# Altium project PCBLaserControlBoardV1.0.PrjPcb (part 1 of 2)
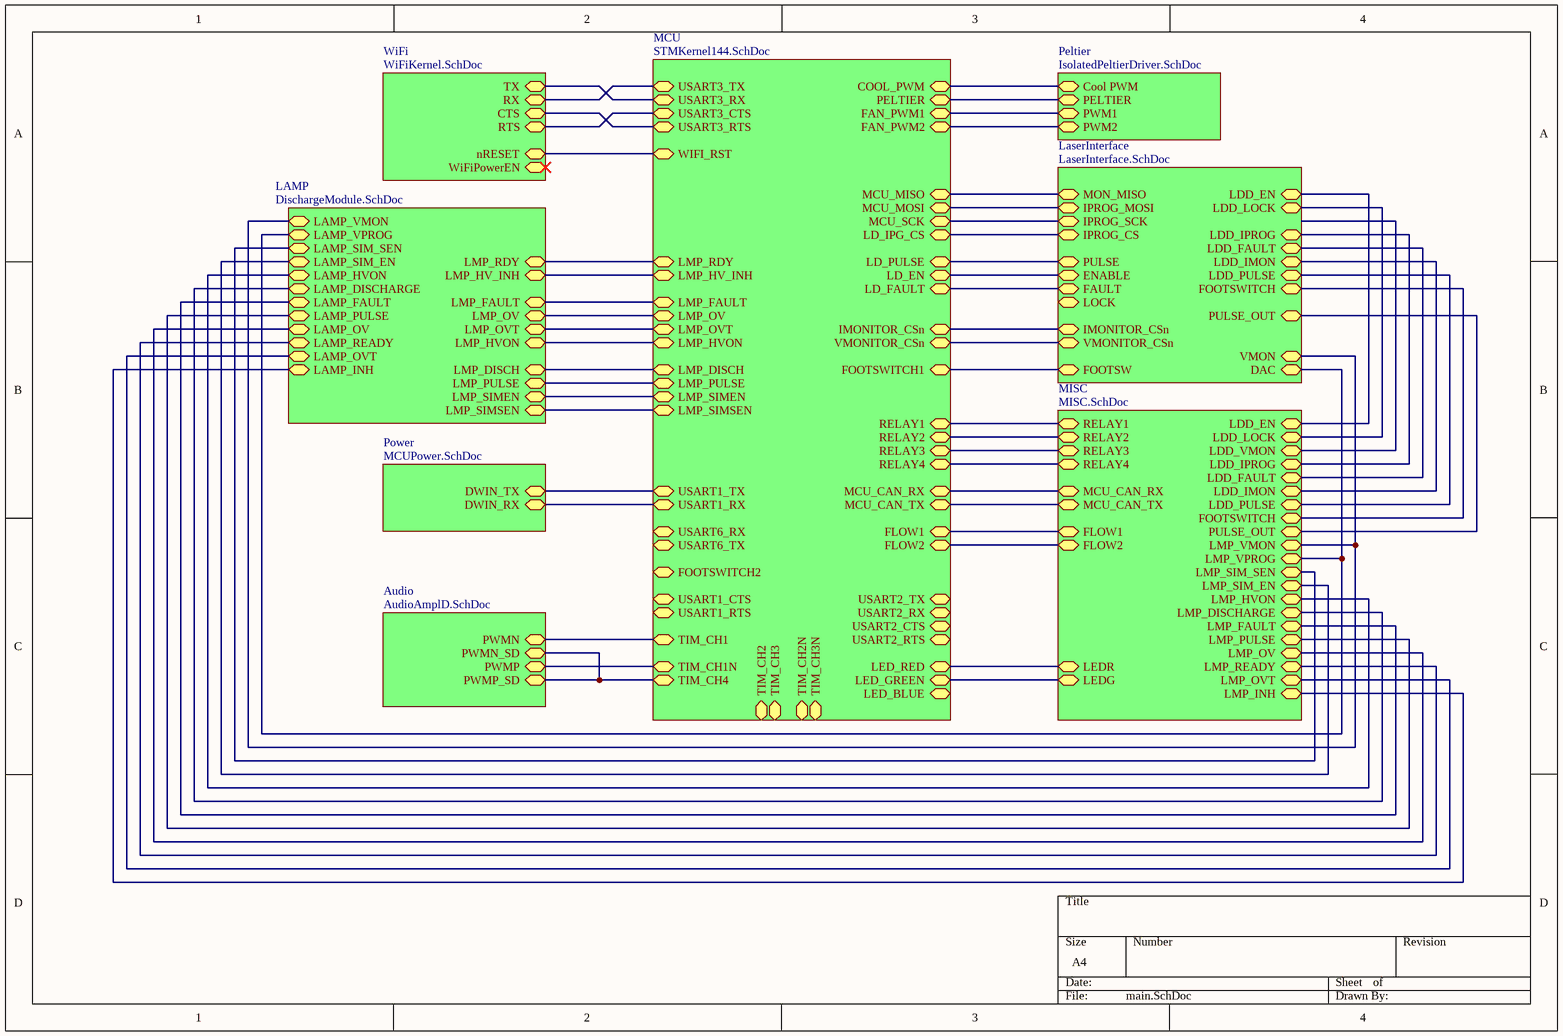
[diagram p0: main.SchDoc]
9 sheets, 386 parts. Net scope: hierarchical (ports join the sheet entries above them; power ports are global).
Board file: LaserControlBoard (extended).PcbDoc
Sheets:
  main.SchDoc
    MCU = STMKernel144.SchDoc
    Peltier = IsolatedPeltierDriver.SchDoc
    WiFi = WiFiKernel.SchDoc
    LaserInterface = LaserInterface.SchDoc
    MISC = MISC.SchDoc
    LAMP = DischargeModule.SchDoc
    Power = MCUPower.SchDoc
    Audio = AudioAmplD.SchDoc

## Sheet main.SchDoc
size A4

### Sub-sheets
Audio = AudioAmplD.SchDoc: PWMN, PWMN_SD, PWMP, PWMP_SD
LAMP = DischargeModule.SchDoc: LMP_SIMSEN, LMP_RDY, LMP_SIMEN, LMP_DISCH, LMP_HV_INH, LMP_FAULT, LMP_OV, LMP_OVT, LMP_HVON, LMP_PULSE, LAMP_VMON, LAMP_VPROG, LAMP_SIM_SEN, LAMP_SIM_EN, LAMP_HVON, LAMP_DISCHARGE, LAMP_FAULT, LAMP_PULSE, LAMP_OV, LAMP_READY, LAMP_OVT, LAMP_INH
LaserInterface = LaserInterface.SchDoc: IPROG_MOSI, IPROG_SCK, IPROG_CS, LOCK, FAULT, ENABLE, PULSE, MON_MISO, IMONITOR_CSn, VMONITOR_CSn, FOOTSW, VMON, DAC, LDD_EN, LDD_LOCK, LDD_IPROG, LDD_FAULT, LDD_IMON, LDD_PULSE, FOOTSWITCH, PULSE_OUT
MCU = STMKernel144.SchDoc: MCU_SCK, MCU_MISO, MCU_MOSI, USART2_CTS, USART2_RTS, USART2_TX, USART2_RX, USART3_TX, USART3_RX, USART3_CTS, USART3_RTS, LD_PULSE, LD_EN, LD_FAULT, LD_IPG_CS, COOL_PWM, PELTIER, RELAY1, FAN_PWM1, FAN_PWM2, IMONITOR_CSn, VMONITOR_CSn, RELAY2, RELAY3, RELAY4, FOOTSWITCH1, LED_RED, LMP_SIMSEN, LMP_RDY, LMP_SIMEN, LMP_DISCH, LMP_PULSE, LMP_HV_INH, LMP_FAULT, LMP_OV, LMP_OVT, LMP_HVON, FOOTSWITCH2, FLOW2, FLOW1, LED_GREEN, LED_BLUE, USART6_TX, USART6_RX, USART1_CTS, USART1_RTS, USART1_TX, USART1_RX, WIFI_RST, TIM_CH1, TIM_CH3, TIM_CH2, TIM_CH4, TIM_CH2N, TIM_CH3N, TIM_CH1N, MCU_CAN_RX, MCU_CAN_TX
MISC = MISC.SchDoc: RELAY1, RELAY2, RELAY3, RELAY4, FLOW1, FLOW2, LEDR, LEDG, LMP_VMON, LMP_VPROG, LMP_SIM_SEN, LMP_SIM_EN, LMP_HVON, LMP_DISCHARGE, LMP_FAULT, LMP_PULSE, LMP_OV, LMP_READY, LMP_OVT, LMP_INH, LDD_EN, LDD_LOCK, LDD_VMON, LDD_IPROG, LDD_FAULT, LDD_IMON, LDD_PULSE, FOOTSWITCH, PULSE_OUT, MCU_CAN_RX, MCU_CAN_TX
Peltier = IsolatedPeltierDriver.SchDoc: Cool PWM, PWM1, PWM2, PELTIER
Power = MCUPower.SchDoc: DWIN_TX, DWIN_RX
WiFi = WiFiKernel.SchDoc: nRESET, RX, TX, CTS, RTS, WiFiPowerEN

### Nets
CAN1_RX: sheet MCU/MCU_CAN_RX, sheet MISC/MCU_CAN_RX
CAN1_TX: sheet MCU/MCU_CAN_TX, sheet MISC/MCU_CAN_TX
CH_NERR: sheet LaserInterface/LDD_FAULT, sheet MISC/LDD_FAULT
DAC_CS: sheet MCU/LD_IPG_CS, sheet LaserInterface/IPROG_CS
DAC_MOSI: sheet MCU/MCU_MOSI, sheet LaserInterface/IPROG_MOSI
DAC_SCK: sheet MCU/MCU_SCK, sheet LaserInterface/IPROG_SCK
DWIN_RX: sheet MCU/USART1_RX, sheet Power/DWIN_RX
DWIN_TX: sheet MCU/USART1_TX, sheet Power/DWIN_TX
FLOW1: sheet MCU/FLOW1, sheet MISC/FLOW1
FLOW2: sheet MCU/FLOW2, sheet MISC/FLOW2
FOOTSW1: sheet MCU/FOOTSWITCH1, sheet LaserInterface/FOOTSW
IM_CSn: sheet MCU/IMONITOR_CSn, sheet LaserInterface/IMONITOR_CSn
LAS_EN: sheet MCU/LD_EN, sheet LaserInterface/ENABLE
LAS_FLT: sheet MCU/LD_FAULT, sheet LaserInterface/FAULT
LASER_ENABLE: sheet LaserInterface/LDD_EN, sheet MISC/LDD_EN
LASER_IMON: sheet LaserInterface/LDD_IMON, sheet MISC/LDD_IMON
LASER_IPROG: sheet LaserInterface/DAC, sheet LaserInterface/LDD_IPROG, sheet MISC/LMP_VPROG, sheet MISC/LDD_IPROG, sheet LAMP/LAMP_VPROG
LASER_LOCK: sheet LaserInterface/LDD_LOCK, sheet MISC/LDD_LOCK
LASER_PULSE: sheet LaserInterface/LDD_PULSE, sheet MISC/LDD_PULSE
LASER_VMON: sheet LaserInterface/VMON, sheet MISC/LMP_VMON, sheet LAMP/LAMP_VMON
LD_PULSE: sheet MCU/LD_PULSE, sheet LaserInterface/PULSE
LEDG: sheet MCU/LED_GREEN, sheet MISC/LEDG
LEDR: sheet MCU/LED_RED, sheet MISC/LEDR
LMP_DISCH: sheet MCU/LMP_DISCH, sheet LAMP/LMP_DISCH
LMP_DISCHARGE: sheet MISC/LMP_DISCHARGE, sheet LAMP/LAMP_DISCHARGE
LMP_FAULT: sheet MCU/LMP_FAULT, sheet LAMP/LMP_FAULT
LMP_FAULT_SIG: sheet MISC/LMP_FAULT, sheet LAMP/LAMP_FAULT
LMP_HV_INH: sheet MCU/LMP_HV_INH, sheet LAMP/LMP_HV_INH
LMP_HV_INHIBIT: sheet MISC/LMP_INH, sheet LAMP/LAMP_INH
LMP_HVON: sheet MCU/LMP_HVON, sheet LAMP/LMP_HVON
LMP_HVON_SIG: sheet MISC/LMP_HVON, sheet LAMP/LAMP_HVON
LMP_OV: sheet MCU/LMP_OV, sheet LAMP/LMP_OV
LMP_OVERTEMPERATURE_SIG: sheet MISC/LMP_OVT, sheet LAMP/LAMP_OVT
LMP_OVERVOLTAGE_SIG: sheet MISC/LMP_OV, sheet LAMP/LAMP_OV
LMP_OVT: sheet MCU/LMP_OVT, sheet LAMP/LMP_OVT
LMP_PULSE: sheet MCU/LMP_PULSE, sheet LAMP/LMP_PULSE
LMP_PULSE_OUT: sheet MISC/LMP_PULSE, sheet LAMP/LAMP_PULSE
LMP_RDY: sheet MCU/LMP_RDY, sheet LAMP/LMP_RDY
LMP_READY: sheet MISC/LMP_READY, sheet LAMP/LAMP_READY
LMP_SIMEN: sheet MCU/LMP_SIMEN, sheet LAMP/LMP_SIMEN
LMP_SIMMER_ENABLE: sheet MISC/LMP_SIM_EN, sheet LAMP/LAMP_SIM_EN
LMP_SIMMER_SENSOR: sheet MISC/LMP_SIM_SEN, sheet LAMP/LAMP_SIM_SEN
LMP_SIMSEN: sheet MCU/LMP_SIMSEN, sheet LAMP/LMP_SIMSEN
RELAY1: sheet MCU/RELAY1, sheet MISC/RELAY1
RELAY2: sheet MCU/RELAY2, sheet MISC/RELAY2
RELAY3: sheet MCU/RELAY3, sheet MISC/RELAY3
RELAY4: sheet MCU/RELAY4, sheet MISC/RELAY4
TIM1_CH1: sheet MCU/TIM_CH1, sheet Audio/PWMN
TIM1_CH1N: sheet MCU/TIM_CH1N, sheet Audio/PWMP
TIM1_CH4: sheet MCU/TIM_CH4, sheet Audio/PWMN_SD, sheet Audio/PWMP_SD
USART3_CTS: sheet MCU/USART3_CTS, sheet WiFi/RTS
USART3_RTS: sheet MCU/USART3_RTS, sheet WiFi/CTS
USART3_RX: sheet MCU/USART3_RX, sheet WiFi/TX
USART3_TX: sheet MCU/USART3_TX, sheet WiFi/RX
VM_CSn: sheet MCU/VMONITOR_CSn, sheet LaserInterface/VMONITOR_CSn
WIFI_RST: sheet MCU/WIFI_RST, sheet WiFi/nRESET
NetP9_37: sheet LaserInterface/FOOTSWITCH, sheet MISC/FOOTSWITCH
NetR2_1: sheet MCU/COOL_PWM, sheet Peltier/Cool PWM
NetR10_1: sheet MCU/PELTIER, sheet Peltier/PELTIER
NetR13_1: sheet MCU/FAN_PWM1, sheet Peltier/PWM1
NetR16_1: sheet MCU/FAN_PWM2, sheet Peltier/PWM2
NetR35#1_1: sheet MCU/MCU_MISO, sheet LaserInterface/MON_MISO
NetR157_1: sheet LaserInterface/PULSE_OUT, sheet MISC/PULSE_OUT

## Sheet STMKernel144.SchDoc
size A3
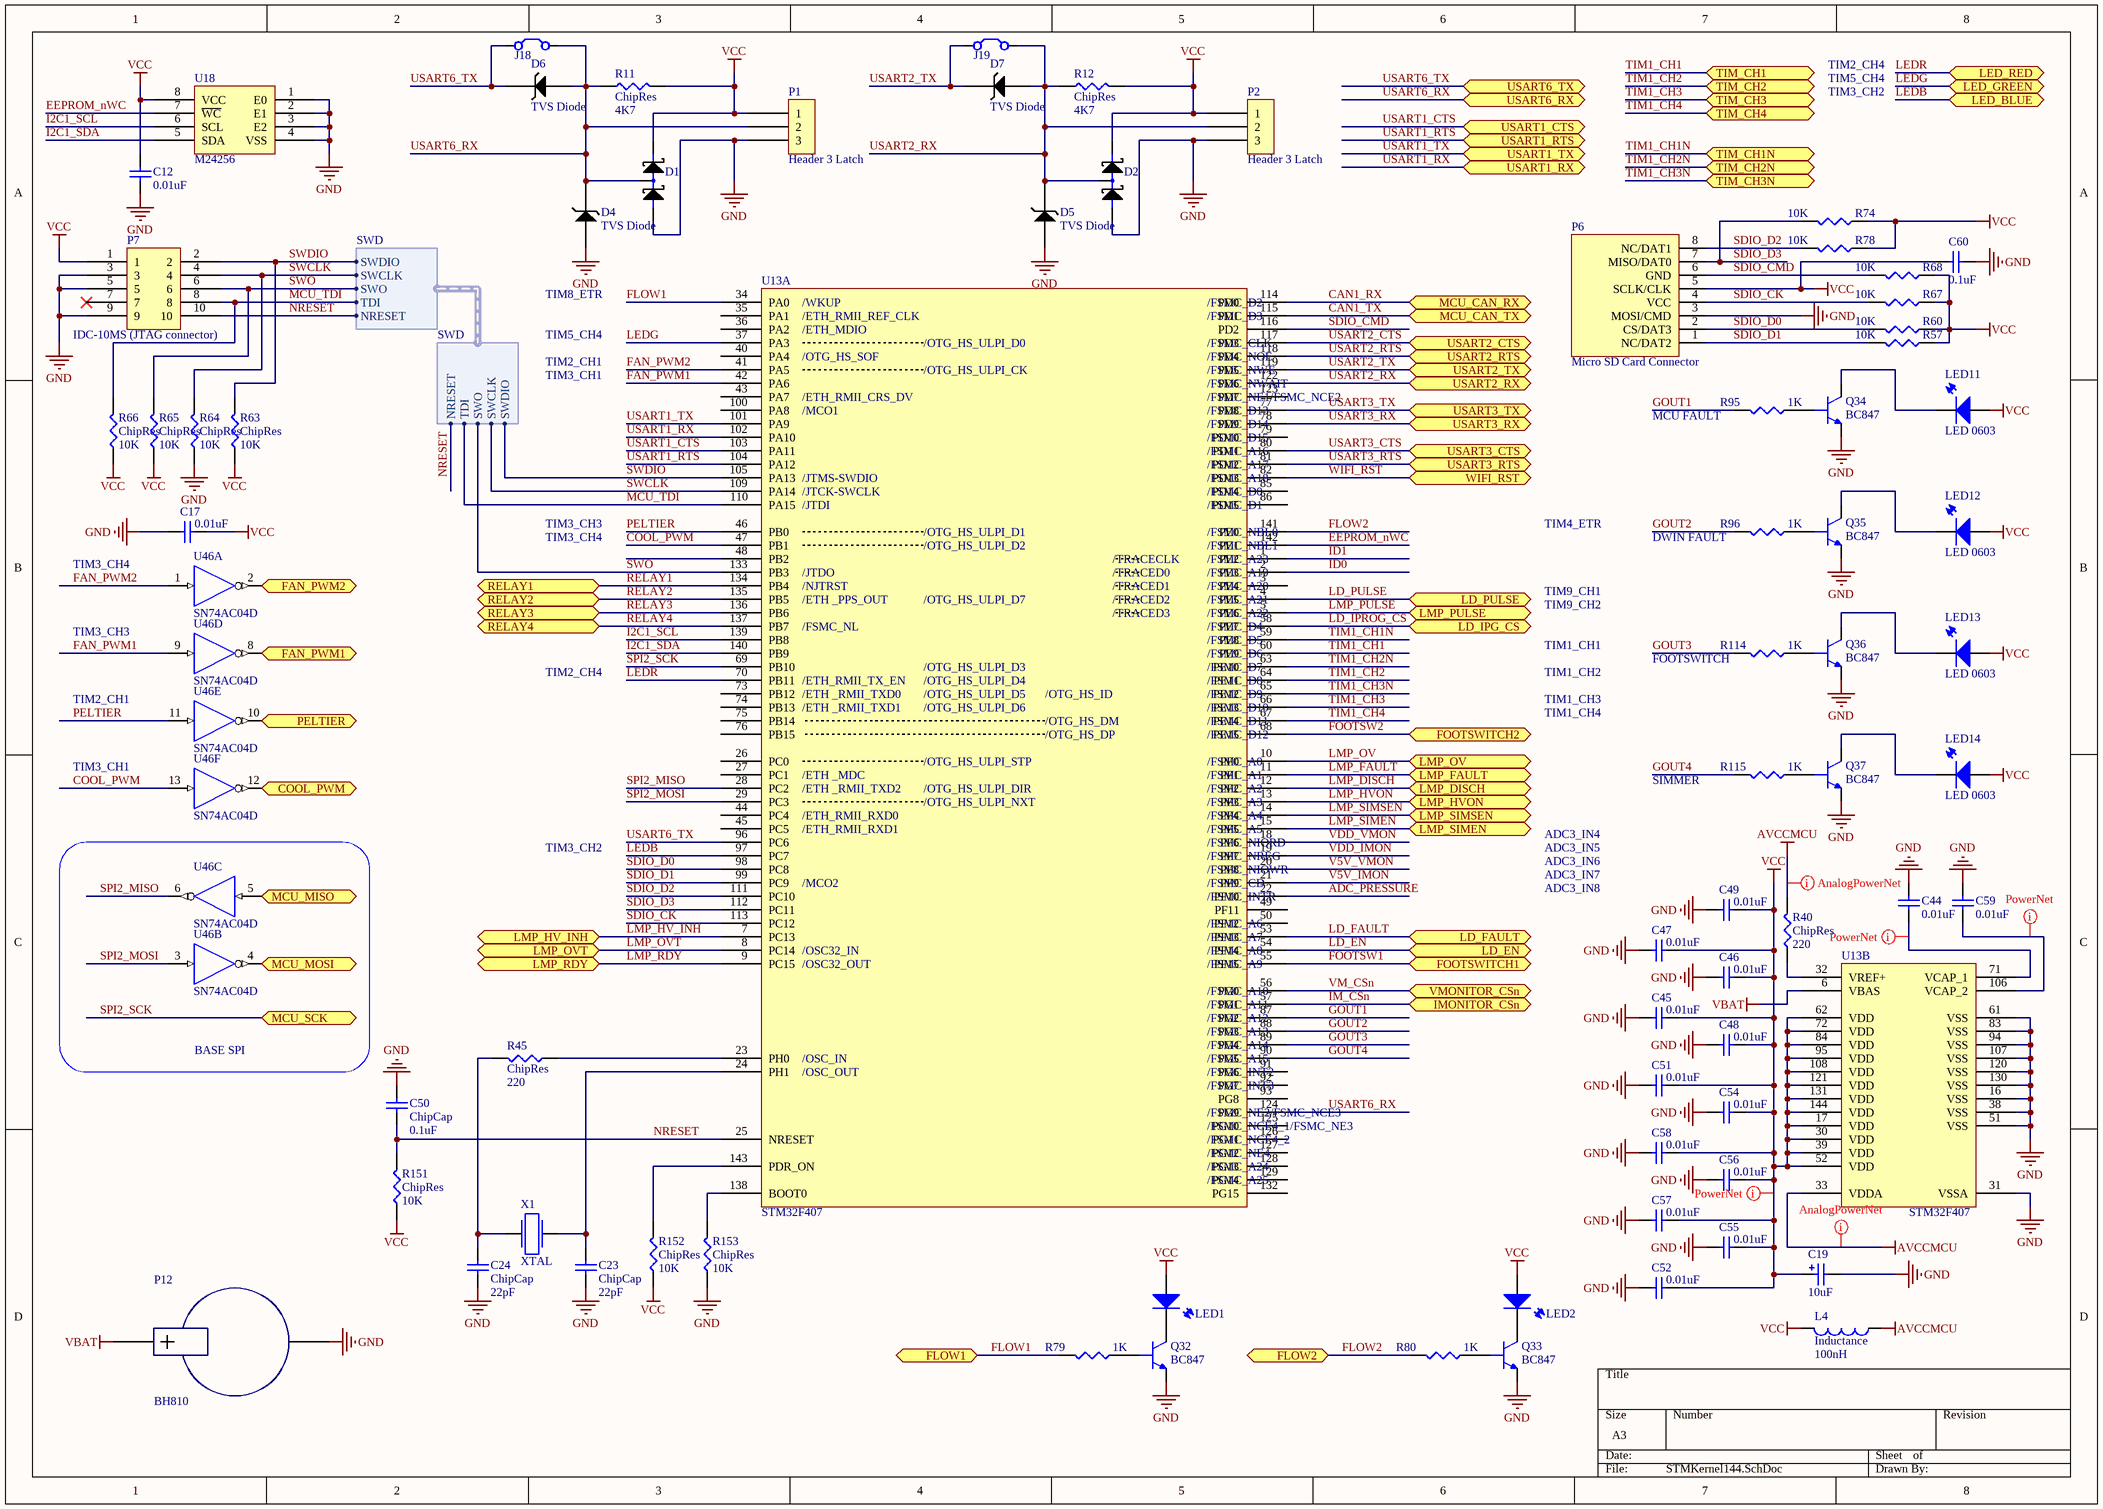
[diagram p1: STMKernel144.SchDoc]

### Parts
C12  value 0.01uF  [CAP0805]  (hidden comment: ChipCap)
C17  value 0.01uF  [CAP0805]  (hidden comment: ChipCap)
C19  value 10uF  [CAPC7343]  (hidden comment: Cap Pol SMD)
C23  ChipCap  value 22pF  [CAP0805]
C24  ChipCap  value 22pF  [CAP0805]
C44  value 0.01uF  [CAP0805]  (hidden comment: ChipCap)
C45  value 0.01uF  [CAP0805]  (hidden comment: ChipCap)
C46  value 0.01uF  [CAP0805]  (hidden comment: ChipCap)
C47  value 0.01uF  [CAP0805]  (hidden comment: ChipCap)
C48  value 0.01uF  [CAP0805]  (hidden comment: ChipCap)
C49  value 0.01uF  [CAP0805]  (hidden comment: ChipCap)
C50  ChipCap  value 0.1uF  [CAP0805]
C51  value 0.01uF  [CAP0805]  (hidden comment: ChipCap)
C52  value 0.01uF  [CAP0805]  (hidden comment: ChipCap)
C54  value 0.01uF  [CAP0805]  (hidden comment: ChipCap)
C55  value 0.01uF  [CAP0805]  (hidden comment: ChipCap)
C56  value 0.01uF  [CAP0805]  (hidden comment: ChipCap)
C57  value 0.01uF  [CAP0805]  (hidden comment: ChipCap)
C58  value 0.01uF  [CAP0805]  (hidden comment: ChipCap)
C59  value 0.01uF  [CAP0805]  (hidden comment: ChipCap)
C60  value 0.1uF  [CAP0805]  (hidden comment: ChipCap)
D1  Diode Schottky  [SOT23]  (value not drawn)
D2  Diode Schottky  [SOT23]  (value not drawn)
D4  TVS Diode  [DO-214AS]
D5  TVS Diode  [DO-214AS]
D6  TVS Diode  [DO-214AS]
D7  TVS Diode  [DO-214AS]
J18  Jumper  [J0805]  (value not drawn)  (net tie, no BOM)
J19  Jumper  [J0805]  (value not drawn)  (net tie, no BOM)
L4  Inductance  value 100nH  [CM45]
LED1  LED 0603  [LED 0603]  (value not drawn)
LED2  LED 0603  [LED 0603]  (value not drawn)
LED11  LED 0603  [PLCC-2]
LED12  LED 0603  [PLCC-2]
LED13  LED 0603  [PLCC-2]
LED14  LED 0603  [PLCC-2]
P1  Header 3 Latch  [Header 3 latch]
P2  Header 3 Latch  [Header 3 latch]
P6  Micro SD Card Connector  [WR-CRD SD Micro]
P7  IDC-10MS (JTAG connector)  [IDC-10MS(MR)]
P12  BH810  [BH810]
Q32  BC847  [SOT23]
Q33  BC847  [SOT23]
Q34  BC847  [SOT23]
Q35  BC847  [SOT23]
Q36  BC847  [SOT23]
Q37  BC847  [SOT23]
R11  ChipRes  value 4K7  [RES0805]
R12  ChipRes  value 4K7  [RES0805]
R40  ChipRes  value 220  [RES0805]
R45  ChipRes  value 220  [RES0805]
R57  value 10K  [RES0805]  (hidden comment: ChipRes)
R60  value 10K  [RES0805]  (hidden comment: ChipRes)
R63  ChipRes  value 10K  [RES0805]
R64  ChipRes  value 10K  [RES0805]
R65  ChipRes  value 10K  [RES0805]
R66  ChipRes  value 10K  [RES0805]
R67  value 10K  [RES0805]  (hidden comment: ChipRes)
R68  value 10K  [RES0805]  (hidden comment: ChipRes)
R74  value 10K  [RES0805]  (hidden comment: ChipRes)
R78  value 10K  [RES0805]  (hidden comment: ChipRes)
R79  value 1K  [RES0805]  (hidden comment: ChipRes)
R80  value 1K  [RES0805]  (hidden comment: ChipRes)
R95  value 1K  [RES0805]  (hidden comment: ChipRes)
R96  value 1K  [RES0805]  (hidden comment: ChipRes)
R114  value 1K  [RES0805]  (hidden comment: ChipRes)
R115  value 1K  [RES0805]  (hidden comment: ChipRes)
R151  ChipRes  value 10K  [RES0805]
R152  ChipRes  value 10K  [RES0805]
R153  ChipRes  value 10K  [RES0805]
U13  STM32F407  [LQFP144]  (parts A,B of 2)
U18  M24256  [SOIC8]
U46  SN74AC04D  [D014_N]  (parts A,B,C,D,E,F of 6)
X1  XTAL  [BCY-W2/E4.7]

### Blocks framed on the sheet
BASE SPI: U46

### Ports
COOL_PWM, FAN_PWM1, FAN_PWM2, FLOW1, FLOW2, FOOTSWITCH1, FOOTSWITCH2, IMONITOR_CSn, LD_EN, LD_FAULT, LD_IPG_CS, LD_PULSE, LED_BLUE, LED_GREEN, LED_RED, LMP_DISCH, LMP_FAULT, LMP_HV_INH, LMP_HVON, LMP_OV, LMP_OVT, LMP_PULSE, LMP_RDY, LMP_SIMEN, LMP_SIMSEN, MCU_CAN_RX, MCU_CAN_TX, MCU_MISO, MCU_MOSI, MCU_SCK, PELTIER, RELAY1, RELAY2, RELAY3, RELAY4, TIM_CH1, TIM_CH1N, TIM_CH2, TIM_CH2N, TIM_CH3, TIM_CH3N, TIM_CH4, USART1_CTS, USART1_RTS, USART1_RX, USART1_TX, USART2_CTS, USART2_RTS, USART2_RX, USART2_TX, USART3_CTS, USART3_RTS, USART3_RX, USART3_TX, USART6_RX, USART6_TX, VMONITOR_CSn, WIFI_RST

### Harnesses
SWD: SWDIO, SWCLK, SWO, TDI, NRESET

### Nets
AVCCMCU: L4.2 R40.2 U13.33(VDDA)
GND: C12.1 C17.1 C19.2 C23.1 C24.1 C44.1 C45.2 C46.2 C47.2 C48.2 C49.2 C50.2 C51.2 C52.1 C54.2 C55.2 C56.2 C57.2 C58.2 C59.1 C60.2 D1.1 D2.1 D4.2 D5.2 P1.3 P2.3 P6.3(MOSI/CMD) P7.3 P7.5 P7.9 P12.1(BN) Q32.2 Q33.2 Q34.2 Q35.2 Q36.2 Q37.2 R64.1 R153.1 U13.16(VSS) U13.31(VSSA) U13.38(VSS) U13.51(VSS) U13.61(VSS) U13.83(VSS) U13.94(VSS) U13.107(VSS) U13.120(VSS) U13.130(VSS) U18.1(E0) U18.2(E1) U18.3(E2) U18.4(VSS) U46.7(GND)
VBAT: P12.2(BP) U13.6(VBAS)
VCC: C12.2 C17.2 C19.1 C45.1 C46.1 C47.1 C48.1 C49.1 C51.1 C52.2 C54.1 C55.1 C56.1 C57.1 C58.1 C60.1 D1.2 D2.2 L4.1 LED1.2 LED2.2 LED11.2 LED12.2 LED13.2 LED14.2 P1.1 P2.1 P6.5(SCLK/CLK) P7.1 R11.2 R12.2 R57.2 R60.2 R63.1 R65.1 R66.1 R67.2 R68.2 R74.2 R78.2 R151.1 R152.1 U13.17(VDD) U13.30(VDD) U13.39(VDD) U13.52(VDD) U13.62(VDD) U13.72(VDD) U13.84(VDD) U13.95(VDD) U13.108(VDD) U13.121(VDD) U13.131(VDD) U13.144(VDD) U18.8(VCC) U46.14(VCC)
ADC_PRESSURE: U13.22(PF10)
CAN1_RX: U13.114(PD0) ; port MCU_CAN_RX
CAN1_TX: U13.115(PD1) ; port MCU_CAN_TX
COOL_PWM: U13.47(PB1) U46.13(A)
DAC_MOSI: U46.4(Y) ; port MCU_MOSI
EEPROM_nWC: U13.142(PE1) U18.7(~{WC})
FAN_PWM1: U13.42(PA6) U46.9(A)
FAN_PWM2: U13.41(PA5) U46.1(A)
FLOW1: R79.1 U13.34(PA0) ; port FLOW1
FLOW2: R80.1 U13.141(PE0) ; port FLOW2
FOOTSW1: U13.55(PF15) ; port FOOTSWITCH1
FOOTSW2: U13.68(PE15) ; port FOOTSWITCH2
GOUT1: R95.1 U13.87(PG2)
GOUT2: R96.1 U13.88(PG3)
GOUT3: R114.1 U13.89(PG4)
GOUT4: R115.1 U13.90(PG5)
I2C1_SCL: U13.139(PB8) U18.6(SCL)
I2C1_SDA: U13.140(PB9) U18.5(SDA)
ID0: U13.2(PE3)
ID1: U13.1(PE2)
IM_CSn: U13.57(PG1) ; port IMONITOR_CSn
LD_EN: U13.54(PF14) ; port LD_EN  [project net LAS_EN]
LD_FAULT: U13.53(PF13) ; port LD_FAULT  [project net LAS_FLT]
LD_IPROG_CS: U13.58(PE7) ; port LD_IPG_CS  [project net DAC_CS]
LD_PULSE: U13.4(PE5) ; port LD_PULSE
LEDB: U13.97(PC7) ; port LED_BLUE
LEDG: U13.37(PA3) ; port LED_GREEN
LEDR: U13.70(PB11) ; port LED_RED
LMP_DISCH: U13.12(PF2) ; port LMP_DISCH
LMP_FAULT: U13.11(PF1) ; port LMP_FAULT
LMP_HV_INH: U13.7(PC13) ; port LMP_HV_INH
LMP_HVON: U13.13(PF3) ; port LMP_HVON
LMP_OV: U13.10(PF0) ; port LMP_OV
LMP_OVT: U13.8(PC14) ; port LMP_OVT
LMP_PULSE: U13.5(PE6) ; port LMP_PULSE
LMP_RDY: U13.9(PC15) ; port LMP_RDY
LMP_SIMEN: U13.15(PF5) ; port LMP_SIMEN
LMP_SIMSEN: U13.14(PF4) ; port LMP_SIMSEN
MCU_TDI: P7.8 R66.2 U13.110(PA15) ; harness SWD.TDI
NRESET: C50.1 P7.10 R151.2 U13.25(NRESET) ; harness SWD.NRESET
PELTIER: U13.46(PB0) U46.11(A)
RELAY1: U13.134(PB4) ; port RELAY1
RELAY2: U13.135(PB5) ; port RELAY2
RELAY3: U13.136(PB6) ; port RELAY3
RELAY4: U13.137(PB7) ; port RELAY4
SDIO_CK: P6.4(VCC) R67.1 U13.113(PC12)
SDIO_CMD: P6.6(GND) R68.1 U13.116(PD2)
SDIO_D0: P6.2(CS/DAT3) R60.1 U13.98(PC8)
SDIO_D1: P6.1(NC/DAT2) R57.1 U13.99(PC9)
SDIO_D2: P6.8(NC/DAT1) R78.1 U13.111(PC10)
SDIO_D3: P6.7(MISO/DAT0) R74.1 U13.112(PC11)
SPI2_MISO: U13.28(PC2) U46.6(Y)
SPI2_MOSI: U13.29(PC3) U46.3(A)
SPI2_SCK: U13.69(PB10) ; port MCU_SCK  [project net DAC_SCK]
SWCLK: P7.4 R64.2 U13.109(PA14) ; harness SWD.SWCLK
SWDIO: P7.2 R63.2 U13.105(PA13) ; harness SWD.SWDIO
SWO: P7.6 R65.2 U13.133(PB3) ; harness SWD.SWO
TIM1_CH1: U13.60(PE9) ; port TIM_CH1
TIM1_CH1N: U13.59(PE8) ; port TIM_CH1N
TIM1_CH2: U13.64(PE11) ; port TIM_CH2
TIM1_CH2N: U13.63(PE10) ; port TIM_CH2N
TIM1_CH3: U13.66(PE13) ; port TIM_CH3
TIM1_CH3N: U13.65(PE12) ; port TIM_CH3N
TIM1_CH4: U13.67(PE14) ; port TIM_CH4
USART1_CTS: U13.103(PA11) ; port USART1_CTS
USART1_RTS: U13.104(PA12) ; port USART1_RTS
USART1_RX: U13.102(PA10) ; port USART1_RX  [project net DWIN_RX]
USART1_TX: U13.101(PA9) ; port USART1_TX  [project net DWIN_TX]
USART2_CTS: U13.117(PD3) ; port USART2_CTS
USART2_RTS: U13.118(PD4) ; port USART2_RTS
USART2_RX: D2.3 D5.1 D7.2 J19.1 P2.2 R12.1 U13.122(PD6) ; port USART2_RX
USART2_TX: D7.1 J19.0 U13.119(PD5) ; port USART2_TX
USART3_CTS: U13.80(PD11) ; port USART3_CTS
USART3_RTS: U13.81(PD12) ; port USART3_RTS
USART3_RX: U13.78(PD9) ; port USART3_RX
USART3_TX: U13.77(PD8) ; port USART3_TX
USART6_RX: D1.3 D4.1 D6.2 J18.1 P1.2 R11.1 U13.124(PG9) ; port USART6_RX
USART6_TX: D6.1 J18.0 U13.96(PC6) ; port USART6_TX
V5V_IMON: U13.21(PF9)
V5V_VMON: U13.20(PF8)
VDD_IMON: U13.19(PF7)
VDD_VMON: U13.18(PF6)
VM_CSn: U13.56(PG0) ; port VMONITOR_CSn
WIFI_RST: U13.82(PD13) ; port WIFI_RST
NetC23_2: C23.2 U13.24(PH1) X1.2
NetC24_2: C24.2 R45.2 X1.1
NetC44_2: C44.2 U13.71(VCAP_1)
NetC59_2: C59.2 U13.106(VCAP_2)
NetLED1_1: LED1.1 Q32.3
NetLED2_1: LED2.1 Q33.3
NetLED11_1: LED11.1 Q34.3
NetLED12_1: LED12.1 Q35.3
NetLED13_1: LED13.1 Q36.3
NetLED14_1: LED14.1 Q37.3
NetQ32_1: Q32.1 R79.2
NetQ33_1: Q33.1 R80.2
NetQ34_1: Q34.1 R95.2
NetQ35_1: Q35.1 R96.2
NetQ36_1: Q36.1 R114.2
NetQ37_1: Q37.1 R115.2
NetR2_1: U46.12(Y) ; port COOL_PWM
NetR10_1: U46.10(Y) ; port PELTIER
NetR13_1: U46.8(Y) ; port FAN_PWM1
NetR16_1: U46.2(Y) ; port FAN_PWM2
NetR35#1_1: U46.5(A) ; port MCU_MISO
NetR40_1: R40.1 U13.32(VREF+)
NetR45_1: R45.1 U13.23(PH0)
NetR152_2: R152.2 U13.143(PDR_ON)
NetR153_2: R153.2 U13.138(BOOT0)

Not connected (* = marked no-connect by the designer): P7 7*; U13 3(PE4) 26(PC0) 27(PC1) 35(PA1) 36(PA2) 40(PA4) 43(PA7) 44(PC4) 45(PC5) 48(PB2) 49(PF11) 50(PF12) 73(PB12) 74(PB13) 75(PB14) 76(PB15) 79(PD10) 85(PD14) 86(PD15) 91(PG6) 92(PG7) 93(PG8) 100(PA8) 123(PD7) 125(PG10) 126(PG11) 127(PG12) 128(PG13) 129(PG14) 132(PG15)

### Layout directives
net class PowerNet: NetC44_2, NetC59_2, VCC
net class AnalogPowerNet: AVCCMCU

### Notes on the sheet
- TIM2_CH4
- TIM5_CH4
- TIM3_CH2
- TIM8_ETR
- TIM2_CH1
- TIM3_CH1
- MCU FAULT
- TIM3_CH4
- TIM3_CH3
- TIM4_ETR
- (near R96) DWIN FAULT
- TIM9_CH1
- TIM9_CH2
- TIM1_CH1
- TIM1_CH2
- TIM1_CH3
- TIM1_CH4
- (near R114) FOOTSWITCH
- SIMMER
- ADC3_IN4
- ADC3_IN5
- ADC3_IN6
- ADC3_IN7
- ADC3_IN8
- (in symbol STM32F407ZGT6, part A) /WKUP; /FSMC_D2; /ETH_RMII_REF_CLK; /FSMC_D3; /ETH_MDIO; /OTG_HS_ULPI_D0; /FSMC_CLK; /OTG_HS_SOF; /FSMC_NOE; /OTG_HS_ULPI_CK; /FSMC_NWE; /FSMC_NWAIT; /ETH_RMII_CRS_DV; /FSMC_NE1/FSMC_NCE2; /MCO1; /FSMC_D13; /FSMC_D14; /FSMC_D15; /FSMC_A16; /FSMC_A17; /JTMS-SWDIO; /FSMC_A18; /JTCK-SWCLK; /FSMC_D0; /JTDI; /FSMC_D1; /OTG_HS_ULPI_D1; /FSMC_NBL0; /OTG_HS_ULPI_D2; /FSMC_NBL1; /TRACECLK; /FSMC_A23; /JTDO; /TRACED0; /FSMC_A19; /NJTRST; /TRACED1; /FSMC_A20; /ETH _PPS_OUT; /OTG_HS_ULPI_D7; /TRACED2; /FSMC_A21; /TRACED3; /FSMC_A22; /FSMC_NL; /FSMC_D4; /FSMC_D5; /FSMC_D6; /OTG_HS_ULPI_D3; /FSMC_D7; /ETH_RMII_TX_EN; /OTG_HS_ULPI_D4; /FSMC_D8; /ETH _RMII_TXD0; /OTG_HS_ULPI_D5; /OTG_HS_ID; /FSMC_D9; /ETH _RMII_TXD1; /OTG_HS_ULPI_D6; /FSMC_D10; /OTG_HS_DM; /FSMC_D11; /OTG_HS_DP; /FSMC_D12; /OTG_HS_ULPI_STP; /FSMC_A0; /ETH _MDC; /FSMC_A1; /ETH _RMII_TXD2; /OTG_HS_ULPI_DIR; /FSMC_A2; /OTG_HS_ULPI_NXT; /FSMC_A3; /ETH_RMII_RXD0; /FSMC_A4; /ETH_RMII_RXD1; /FSMC_A5; /FSMC_NIORD; /FSMC_NREG; /FSMC_NIOWR; /MCO2; /FSMC_CD; /FSMC_INTR; /FSMC_A6; /FSMC_A7; /OSC32_IN; /FSMC_A8; /OSC32_OUT; /FSMC_A9; /FSMC_A10; /FSMC_A11; /FSMC_A12; /FSMC_A13; /FSMC_A14; /OSC_IN; /FSMC_A15; /OSC_OUT; /FSMC_INT2; /FSMC_INT3; /FSMC_NE2/FSMC_NCE3; /FSMC_NCE4_1/FSMC_NE3; /FSMC_NCE4_2; /FSMC_NE4; /FSMC_A24; /FSMC_A25

### Library data of the parts
C12 C17 C23 C24 C44-C52 C54-C60 = ChipCap: Capacitor; Published: 8-Jun-2000; LatestRevisionDate: 17-Jul-2002; LatestRevisionNote: Re-released for DXP Platform.; PackageReference: RAD-0.3; Publisher: Altium Limited
C19 = Cap Pol Chip: Polarized Capacitor (Radial); Supplier 1: Digi-Key; Supplier Part Number 1: 399-4029-1-ND
D1 D2 = Schottky Diode: 2-Diode Schottky
D4-D7 = TVS Diode SMA
L4 = ChipInductance
LED1 LED2 LED11-LED14 = LED0603
P1 P2 = Header 3 latch: Header 3 with latch
P6 = MicroSDHeader8
Q32-Q37 = BC847: NPN transistor
R11 R12 R40 R45 R57 R60 R63-R68 R74 R78-R80 R95 R96 R114 R115 R151-R153 = ChipRes: Chip resistor
U13 = STM32F407ZGT6: ST Microcontroller ARM 32-bit Cortex M4
U18 = M24256: 256 Kbit I2C EEPROM
U46 = SN74AC04D: Hex Inverter; Published: 8-Jun-2000; LatestRevisionDate: 13-Apr-2006; LatestRevisionNote: IPC-7351 Footprint Added.; DatasheetVersion: Sep-1996; PackageVersion: Jan-1998; PackageReference: D014; Publisher: Altium Limited; PackageDescription: 14-Pin Small Outline Integrated Circuit 1.27 mm Pitch; Code_IPC: SOIC127P600-14; ComponentLink1Description: Manufacturer Link; ComponentLink1URL: http://www.ti.com/; ComponentLink2Description: Datasheet; ComponentLink2URL: http://www-s.ti.com/sc/ds/sn74ac04.pdf; ComponentLink3Description: Packaging Specification; ComponentLink3URL: http://focus.ti.com/lit/ml/mpds177/mpds177.pdf
X1 = Crystall oscillator: Quartz crystall oscillator

## Sheet IsolatedPeltierDriver.SchDoc
size A4
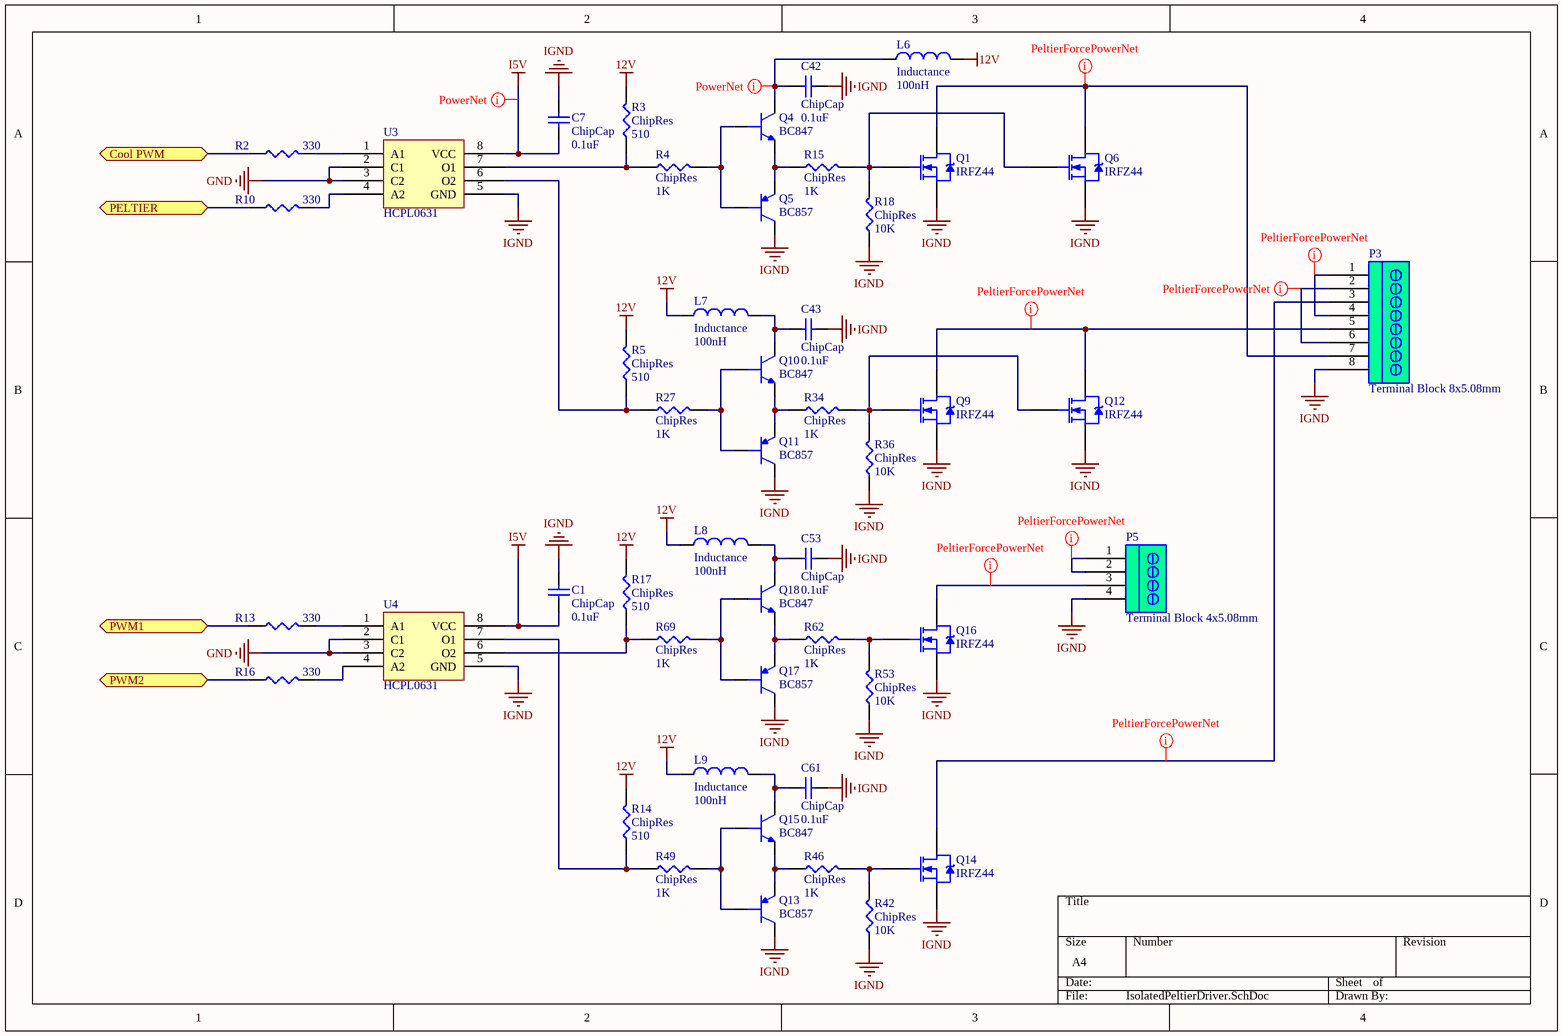
[diagram p2: IsolatedPeltierDriver.SchDoc]

### Parts
(Parts that share a designator on the sheet are numbered #1, #2 ... from top to bottom, then left to right.)
C1  ChipCap  value 0.1uF  [CAP0805]
C7  ChipCap  value 0.1uF  [CAP0805]
C42  ChipCap  value 0.1uF  [CAP0805]
C43  ChipCap  value 0.1uF  [CAP0805]
C53  ChipCap  value 0.1uF  [CAP0805]
C61  ChipCap  value 0.1uF  [CAP0805]
L6  Inductance  value 100nH  [CM45]
L7  Inductance  value 100nH  [CM45]
L8  Inductance  value 100nH  [CM45]
L9  Inductance  value 100nH  [CM45]
P3  Terminal Block 8x5.08mm  [SOCKET 8x5.08]
P5  Terminal Block 4x5.08mm  [Socket 4x5.08]
Q1  IRFZ44  [TO-263AB]
Q4  BC847  [SOT23]
Q5  BC857  [SOT23]
Q6  IRFZ44  [TO-263AB]
Q9  IRFZ44  [TO-263AB]
Q10  BC847  [SOT23]
Q11  BC857  [SOT23]
Q12  IRFZ44  [TO-263AB]
Q13  BC857  [SOT23]
Q14  IRFZ44  [TO-263AB]
Q15  BC847  [SOT23]
Q16  IRFZ44  [TO-263AB]
Q17  BC857  [SOT23]
Q18  BC847  [SOT23]
R2  value 330  [RES0805]  (hidden comment: ChipRes)
R3  ChipRes  value 510  [RES0805]
R4  ChipRes  value 1K  [RES0805]
R5  ChipRes  value 510  [RES0805]
R10  value 330  [RES0805]  (hidden comment: ChipRes)
R13  value 330  [RES0805]  (hidden comment: ChipRes)
R14  ChipRes  value 510  [RES0805]
R15  ChipRes  value 1K  [RES0805]
R16  value 330  [RES0805]  (hidden comment: ChipRes)
R17  ChipRes  value 510  [RES0805]
R18  ChipRes  value 10K  [RES0805]
R27  ChipRes  value 1K  [RES0805]
R34  ChipRes  value 1K  [RES0805]
R36#1  ChipRes  value 10K  [RES0805]
R42  ChipRes  value 10K  [RES0805]
R46  ChipRes  value 1K  [RES0805]
R49  ChipRes  value 1K  [RES0805]
R53  ChipRes  value 10K  [RES0805]
R62  ChipRes  value 1K  [RES0805]
R69  ChipRes  value 1K  [RES0805]
U3  HCPL0631  [SOIC8]
U4  HCPL0631  [SOIC8]

### Ports
Cool PWM, PELTIER, PWM1, PWM2

### Nets
12V: L6.1 L7.2 L8.2 L9.2 R3.2 R5.2 R14.2 R17.2
GND: U3.2(C1) U3.3(C2) U4.2(C1) U4.3(C2)
I5V: C1.2 C7.2 U3.8(VCC) U4.8(VCC)
IGND: C1.1 C7.1 C42.2 C43.2 C53.2 C61.2 P3.8 P5.4 Q1.3(S) Q5.3 Q6.3(S) Q9.3(S) Q11.3 Q12.3(S) Q13.3 Q14.3(S) Q16.3(S) Q17.3 R18.1 R36#1.1 R42.1 R53.1 U3.5(GND) U4.5(GND)
NetC42_1: C42.1 L6.2 Q4.3
NetC43_1: C43.1 L7.1 Q10.3
NetC53_1: C53.1 L8.1 Q18.3
NetC61_1: C61.1 L9.1 Q15.3
NetP3_1: P3.1 P3.4
NetP3_2: P3.2 P3.6
NetP3_3: P3.3 Q14.2(D)
NetP3_5: P3.5 Q9.2(D) Q12.2(D)
NetP3_7: P3.7 Q1.2(D) Q6.2(D)
NetP5_1: P5.1 P5.2
NetP5_3: P5.3 Q16.2(D)
NetQ1_1: Q1.1(G) Q6.1(G) R15.2 R18.2
NetQ4_1: Q4.1 Q5.1 R4.2
NetQ4_2: Q4.2 Q5.2 R15.1
NetQ9_1: Q9.1(G) Q12.1(G) R34.2 R36#1.2
NetQ10_1: Q10.1 Q11.1 R27.2
NetQ10_2: Q10.2 Q11.2 R34.1
NetQ13_1: Q13.1 Q15.1 R49.2
NetQ13_2: Q13.2 Q15.2 R46.1
NetQ14_1: Q14.1(G) R42.2 R46.2
NetQ16_1: Q16.1(G) R53.2 R62.2
NetQ17_1: Q17.1 Q18.1 R69.2
NetQ17_2: Q17.2 Q18.2 R62.1
NetR2_1: R2.1 ; port Cool PWM
NetR2_2: R2.2 U3.1(A1)
NetR3_1: R3.1 R4.1 U3.7(O1)
NetR5_1: R5.1 R27.1 U3.6(O2)
NetR10_1: R10.1 ; port PELTIER
NetR10_2: R10.2 U3.4(A2)
NetR13_1: R13.1 ; port PWM1
NetR13_2: R13.2 U4.1(A1)
NetR14_1: R14.1 R49.1 U4.7(O1)
NetR16_1: R16.1 ; port PWM2
NetR16_2: R16.2 U4.4(A2)
NetR17_1: R17.1 R69.1 U4.6(O2)

### Layout directives
net class PeltierForcePowerNet: NetP3_1, NetP3_2, NetP3_3, NetP3_5, NetP3_7, NetP5_1, NetP5_3
net class Undefined: I5V, NetC42_1

### Library data of the parts
C1 C7 C42 C43 C53 C61 = ChipCap: Capacitor; Published: 8-Jun-2000; LatestRevisionDate: 17-Jul-2002; LatestRevisionNote: Re-released for DXP Platform.; PackageReference: RAD-0.3; Publisher: Altium Limited
L6-L9 = ChipInductance
P3 = Socket_8x5.08_RA_2Wall: Terminal Block Socket Right Angle 8x5.08mm 2-Wall
P5 = Socket_4x5.08_RA_2Wall: Terminal Block Socket Right Angle 4x5.08mm 2-Wall
Q1 Q6 Q9 Q12 Q14 Q16 = IRFZ44: HEXFET N-Channel Power MOSFET; Note: Pin 2 is electrically connected to pin 4.; Published: 8-Jun-2000; LatestRevisionDate: 17-Jul-2002; LatestRevisionNote: Re-released for DXP Platform.; DatasheetVersion: PD-9.510C; PackageVersion: Feb-1997; PackageReference: TO-220AB; Publisher: Altium Limited; PackageDescription: TO, Thru-Hole, Vertical, Heatsink Mounted; 3 In-Line Leads; Pitch 2.54 mm; ComponentLink1Description: Manufacturer Link; ComponentLink1URL: http://www.irf.com/; ComponentLink2Description: Datasheet; ComponentLink2URL: http://www.irf.com/product-info/datasheets/data/irfz44.pdf
Q4 Q10 Q15 Q18 = BC847: NPN transistor
Q5 Q11 Q13 Q17 = BC857: PNP Transistor
R2-R5 R10 R13-R18 R27 R34 R36#1 R42 R46 R49 R53 R62 R69 = ChipRes: Chip resistor
U3 U4 = HCPL0631: 2-channel opto-coupler

## Sheet WiFiKernel.SchDoc
size A4
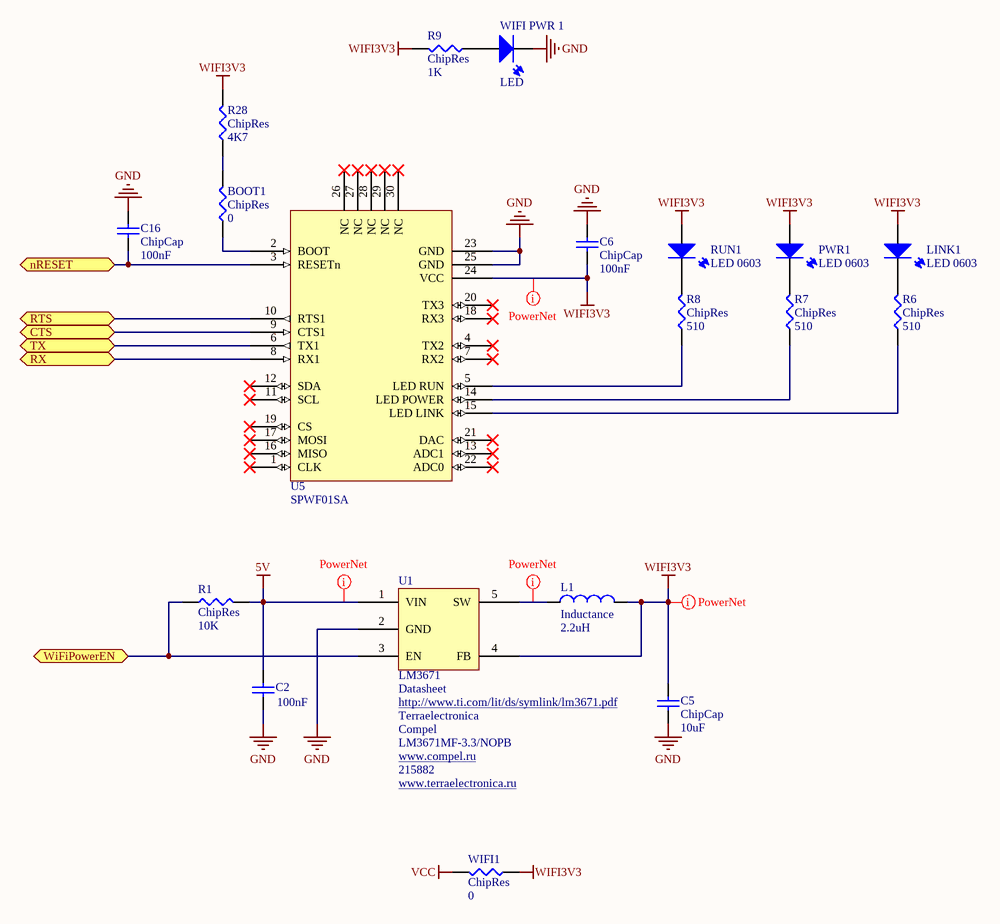
[diagram p3: WiFiKernel.SchDoc]

### Parts
BOOT1  ChipRes  value 0  [RES0805]
C2  value 100nF  [CAP1210]  (hidden comment: ChipCap)
C5  ChipCap  value 10uF  [CAP1210]
C6  ChipCap  value 100nF  [CAP0805]
C16  ChipCap  value 100nF  [CAP0805]
L1  Inductance  value 2.2uH  [CDRH2D14]
LINK1  LED 0603  [LED 0603]
PWR1  LED 0603  [LED 0603]
R1  ChipRes  value 10K  [RES0805]
R6  ChipRes  value 510  [RES0805]
R7  ChipRes  value 510  [RES0805]
R8  ChipRes  value 510  [RES0805]
R9  ChipRes  value 1K  [RES0805]
R28  ChipRes  value 4K7  [RES0805]
RUN1  LED 0603  [LED 0603]
U1  LM3671  ComponentLink1Description: Datasheet  Supplier 1: Terraelectronica  Supplier 2: Compel  Supplier Part Number 2: LM3671MF-3.3/NOPB  Supplier Part Number 1: 215882  [SOT23-5]
U5  SPWF01SA  [SPWF01SA]
WIFI1  ChipRes  value 0  [RES0805]
WIFI_PWR_1  LED  [PLCC-2]

### Ports
CTS, nRESET, RTS, RX, TX, WiFiPowerEN

### Nets
5V: C2.2 R1.2 U1.1(VIN)
GND: C2.1 C5.1 C6.1 C16.1 U1.2(GND) U5.23(GND) U5.25(GND) WIFI_PWR_1.1
VCC: WIFI1.2
WIFI3V3: C5.2 C6.2 L1.1 LINK1.2 PWR1.2 R9.2 R28.1 RUN1.2 U1.4(FB) U5.24(VCC) WIFI1.1
USART3_CTS: U5.10(RTS1) ; port RTS
USART3_RTS: U5.9(CTS1) ; port CTS
USART3_RX: U5.6(TX1) ; port TX
USART3_TX: U5.8(RX1) ; port RX
WIFI_RST: C16.2 U5.3(RESETn) ; port nRESET
NetBOOT1_1: BOOT1.1 R28.2
NetBOOT1_2: BOOT1.2 U5.2(BOOT)
NetL1_2: L1.2 U1.5(SW)
NetLINK1_1: LINK1.1 R6.1
NetPWR1_1: PWR1.1 R7.1
NetR1_1: R1.1 U1.3(EN) ; port WiFiPowerEN
NetR6_2: R6.2 U5.15(LED_LINK)
NetR7_2: R7.2 U5.14(LED_POWER)
NetR8_1: R8.1 RUN1.1
NetR8_2: R8.2 U5.5(LED_RUN)
NetR9_1: R9.1 WIFI_PWR_1.2

Not connected (* = marked no-connect by the designer): U5 1(CLK)* 4(TX2)* 7(RX2)* 11(SCL)* 12(SDA)* 13(ADC1)* 16(MISO)* 17(MOSI)* 18(RX3)* 19(CS)* 20(TX3)* 21(DAC)* 22(ADC0)* 26(NC)* 27(NC)* 28(NC)* 29(NC)* 30(NC)*

### Layout directives
net class Undefined: 5V, NetL1_2, WIFI3V3

### Library data of the parts
BOOT1 R1 R6-R9 R28 WIFI1 = ChipRes: Chip resistor
C2 C5 C6 C16 = ChipCap: Capacitor; Published: 8-Jun-2000; LatestRevisionDate: 17-Jul-2002; LatestRevisionNote: Re-released for DXP Platform.; PackageReference: RAD-0.3; Publisher: Altium Limited
L1 = ChipInductance
LINK1 PWR1 RUN1 WIFI_PWR_1 = LED0603
U1 = LM3671MF: 600-mA Step-Down DC-DC Converter; ComponentLink1URL: http://www.ti.com/lit/ds/symlink/lm3671.pdf; Supplier URL 2: www.compel.ru; Supplier URL 1: www.terraelectronica.ru
U5 = SPWF01: Serial-to-Wi-Fi b/g/n intelligent module

## Sheet LaserInterface.SchDoc
size A3
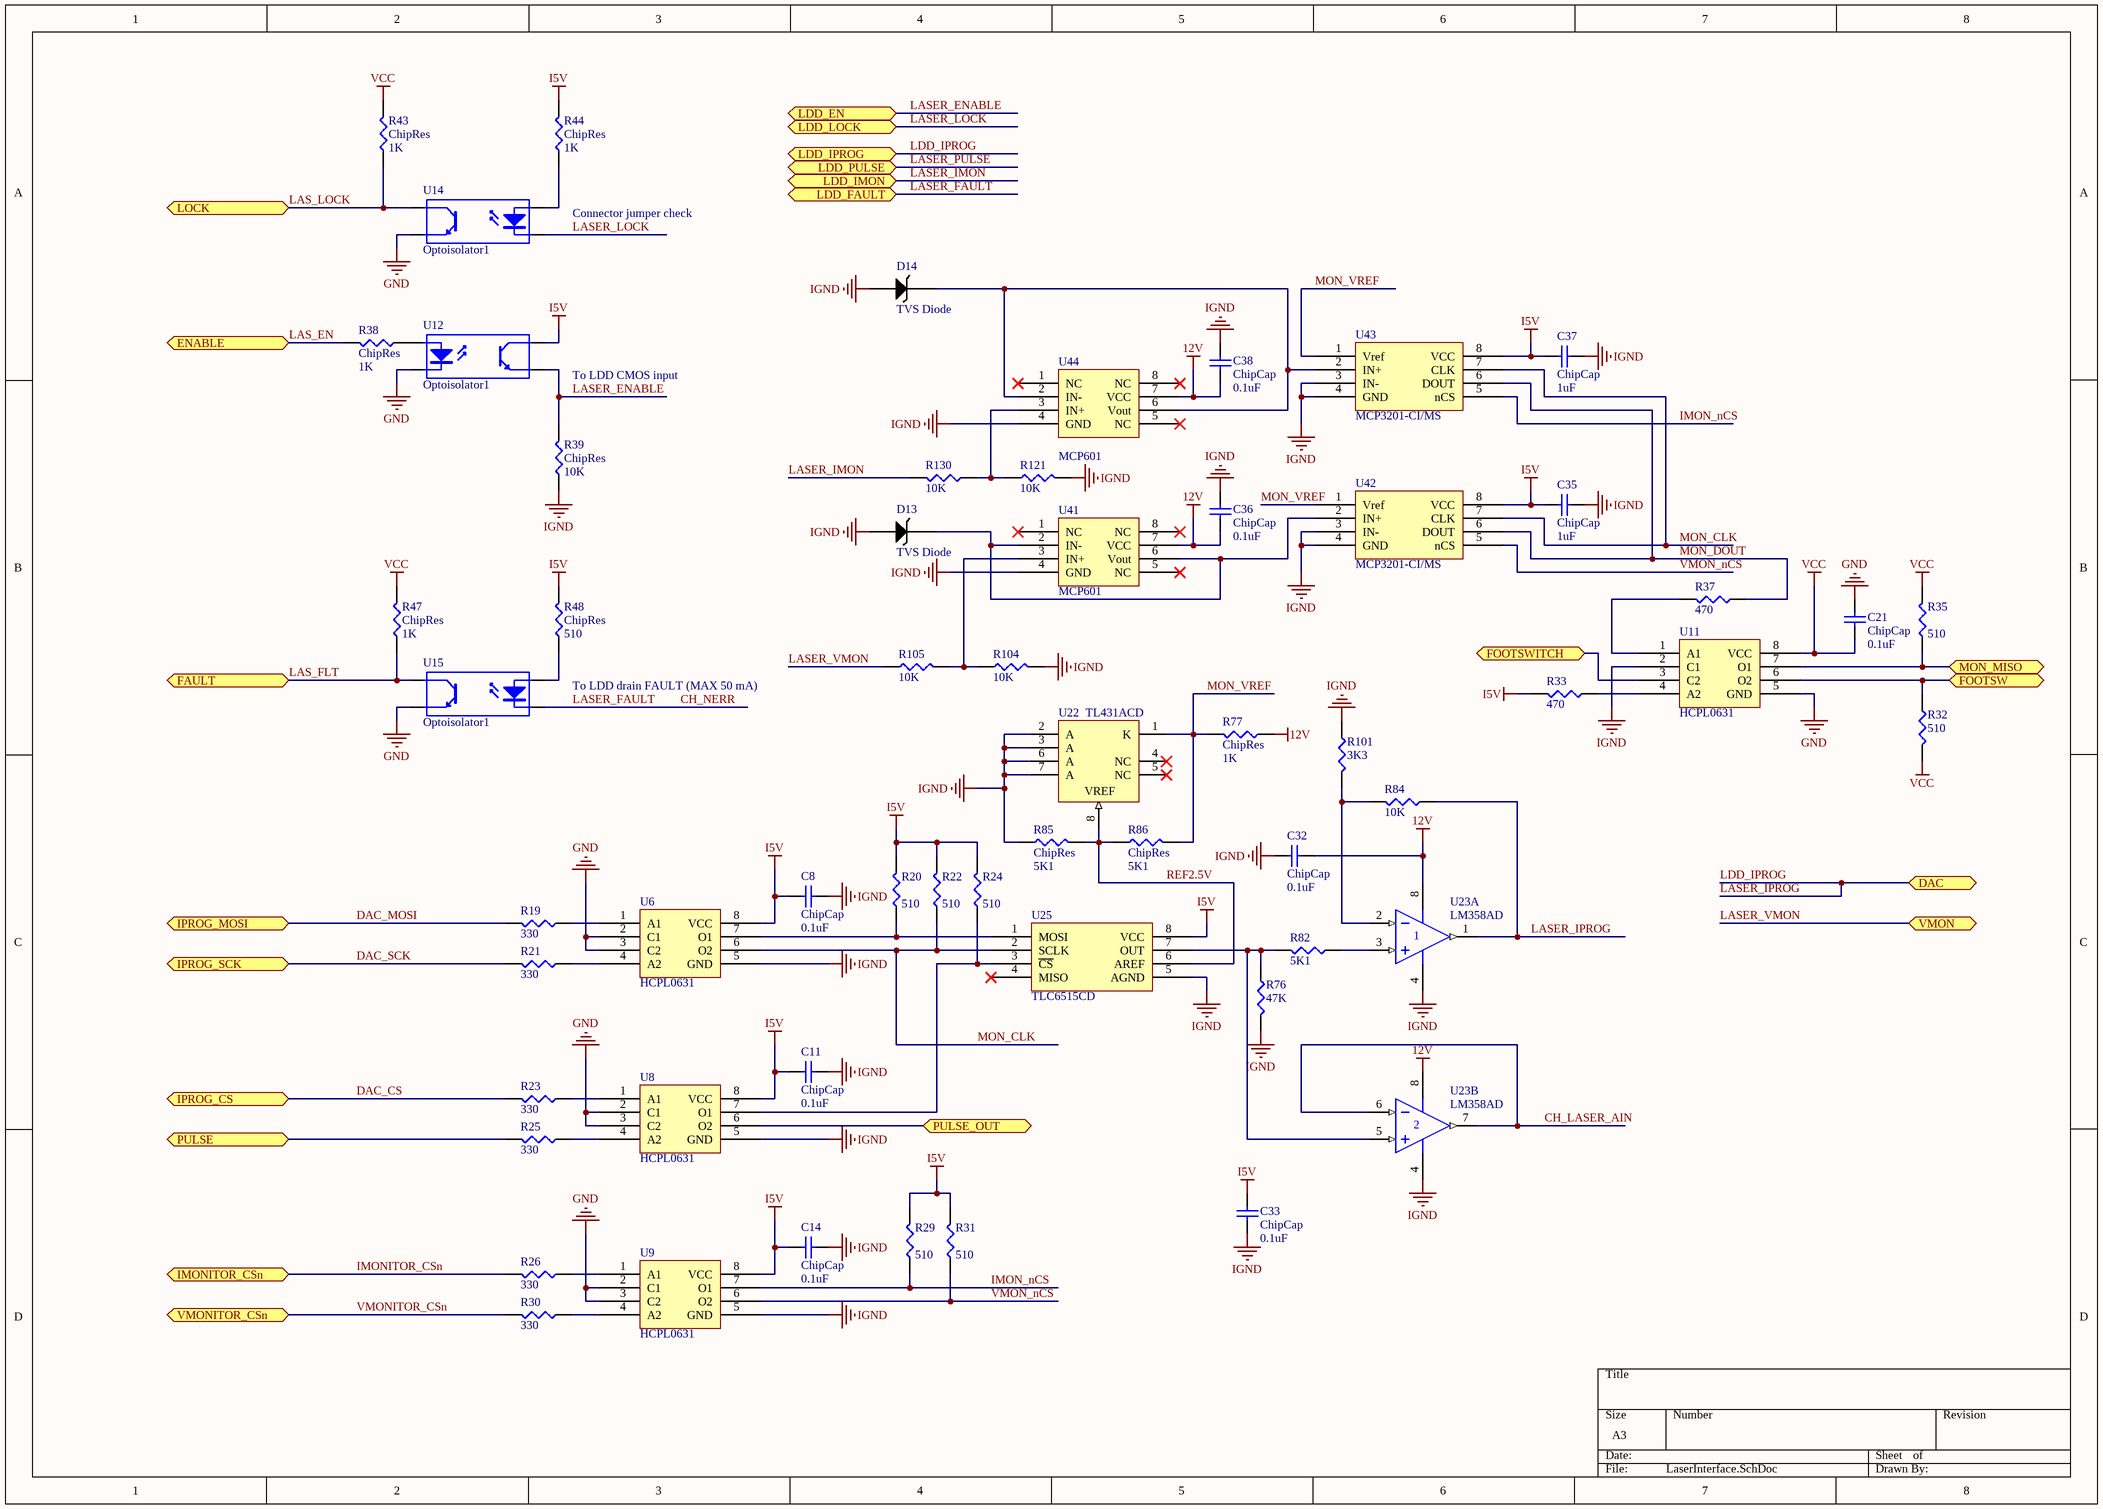
[diagram p4: LaserInterface.SchDoc]

### Parts
(Parts that share a designator on the sheet are numbered #1, #2 ... from top to bottom, then left to right.)
C8  ChipCap  value 0.1uF  [CAP0805]
C11  ChipCap  value 0.1uF  [CAP0805]
C14  ChipCap  value 0.1uF  [CAP0805]
C21  ChipCap  value 0.1uF  [CAP0805]
C32  ChipCap  value 0.1uF  [CAP0805]
C33  ChipCap  value 0.1uF  [CAP0805]
C35  ChipCap  value 1uF  [CAP0805]
C36  ChipCap  value 0.1uF  [CAP0805]
C37  ChipCap  value 1uF  [CAP0805]
C38  ChipCap  value 0.1uF  [CAP0805]
D13  TVS Diode  [DO-214AS]
D14  TVS Diode  [DO-214AS]
R19  value 330  [RES0805]  (hidden comment: ChipRes)
R20  value 510  [RES0805]  (hidden comment: ChipRes)
R21  value 330  [RES0805]  (hidden comment: ChipRes)
R22  value 510  [RES0805]  (hidden comment: ChipRes)
R23  value 330  [RES0805]  (hidden comment: ChipRes)
R24  value 510  [RES0805]  (hidden comment: ChipRes)
R25  value 330  [RES0805]  (hidden comment: ChipRes)
R26  value 330  [RES0805]  (hidden comment: ChipRes)
R29  value 510  [RES0805]  (hidden comment: ChipRes)
R30  value 330  [RES0805]  (hidden comment: ChipRes)
R31  value 510  [RES0805]  (hidden comment: ChipRes)
R32  value 510  [RES0805]  (hidden comment: ChipRes)
R33  value 470  [RES0805]  (hidden comment: ChipRes)
R35#1  value 510  [RES0805]  (hidden comment: ChipRes)
R37  value 470  [RES0805]  (hidden comment: ChipRes)
R38  ChipRes  value 1K  [RES0805]
R39  ChipRes  value 10K  [RES0805]
R43  ChipRes  value 1K  [RES0805]
R44  ChipRes  value 1K  [RES0805]
R47  ChipRes  value 1K  [RES0805]
R48  ChipRes  value 510  [RES0805]
R76  value 47K  [RES0805]  (hidden comment: ChipRes)
R77  ChipRes  value 1K  [RES0805]
R82  value 5K1  [RES0805]  (hidden comment: ChipRes)
R84  value 10K  [RES0805]  (hidden comment: ChipRes)
R85  ChipRes  value 5K1  [RES0805]
R86  ChipRes  value 5K1  [RES0805]
R101  value 3K3  [RES0805]  (hidden comment: ChipRes)
R104  value 10K  [RES0805]  (hidden comment: ChipRes)
R105  value 10K  [RES0805]  (hidden comment: ChipRes)
R121  value 10K  [RES0805]  (hidden comment: ChipRes)
R130  value 10K  [RES0805]  (hidden comment: ChipRes)
U6  HCPL0631  [SOIC8]
U8  HCPL0631  [SOIC8]
U9  HCPL0631  [SOIC8]
U11  HCPL0631  [SOIC8]
U12  Optoisolator1  [DIP-4]
U14  Optoisolator1  [DIP-4]
U15  Optoisolator1  [DIP-4]
U22  TL431ACD  [D008_N]
U23  LM358AD  [D008_L]  (parts A,B of 2)
U25  TLC6515CD  [SOIC8]
U41  MCP601  [SOIC8]
U42  MCP3201-CI/MS  [MSOP8]
U43  MCP3201-CI/MS  [MSOP8]
U44  MCP601  [SOIC8]

### Ports
DAC, ENABLE, FAULT, FOOTSW, FOOTSWITCH, IMONITOR_CSn, IPROG_CS, IPROG_MOSI, IPROG_SCK, LDD_EN, LDD_FAULT, LDD_IMON, LDD_IPROG, LDD_LOCK, LDD_PULSE, LOCK, MON_MISO, PULSE, PULSE_OUT, VMON, VMONITOR_CSn

### Nets
12V: C32.1 C36.2 C38.2 R77.1 U23.8(V+) U41.7(VCC) U44.7(VCC)
GND: C21.1 U6.2(C1) U6.3(C2) U8.2(C1) U8.3(C2) U9.2(C1) U9.3(C2) U11.5(GND) U12.2(K) U14.3(E) U15.3(E)
I5V: C8.2 C11.2 C14.2 C33.1 C35.2 C37.2 R20.2 R22.2 R24.2 R29.2 R31.2 R33.2 R44.2 R48.2 U6.8(VCC) U8.8(VCC) U9.8(VCC) U12.4(C) U25.8(VCC) U42.8(VCC) U43.8(VCC)
IGND: C8.1 C11.1 C14.1 C32.2 C33.2 C35.1 C36.1 C37.1 C38.1 D13.2 D14.2 R39.1 R76.2 R85.1 R101.1 R104.2 R121.2 U6.5(GND) U8.5(GND) U9.5(GND) U11.2(C1) U22.2(A) U22.3(A) U22.6(A) U22.7(A) U23.4(V-) U25.5(AGND) U41.4(GND) U42.3(IN-) U42.4(GND) U43.3(IN-) U43.4(GND) U44.4(GND)
VCC: C21.2 R32.2 R35#1.2 R43.2 R47.2 U11.8(VCC)
CH_LASER_AIN: U23.6(IN-) U23.7(OUT)
CH_NERR: U15.2(K) ; port LDD_FAULT  [also labelled LASER_FAULT]
DAC_CS: R23.2 ; port IPROG_CS
DAC_MOSI: R19.2 ; port IPROG_MOSI
DAC_SCK: R21.2 ; port IPROG_SCK
FOOTSW1: R32.1 U11.6(O2) ; port FOOTSW
IMON_nCS: R29.1 U9.7(O1) U43.5(nCS)
IMONITOR_CSn: R26.2 ; port IMONITOR_CSn  [project net IM_CSn]
LAS_EN: R38.2 ; port ENABLE
LAS_FLT: R47.1 U15.4(C) ; port FAULT
LAS_LOCK: R43.1 U14.4(C) ; port LOCK
LASER_ENABLE: R39.2 U12.3(E) ; port LDD_EN
LASER_IMON: R130.2 ; port LDD_IMON
LASER_IPROG: R84.1 U23.1(OUT) ; port DAC, port LDD_IPROG  [also labelled LDD_IPROG]
LASER_LOCK: U14.2(K) ; port LDD_LOCK
LASER_VMON: R105.1 ; port VMON
LD_PULSE: R25.2 ; port PULSE
MON_CLK: R22.1 U6.6(O2) U25.2(SCLK) U42.7(CLK) U43.7(CLK)
MON_DOUT: R37.1 U42.6(DOUT) U43.6(DOUT)
MON_VREF: R77.2 R86.2 U22.1(K) U42.1(Vref) U43.1(Vref)
REF2.5V: R85.2 R86.1 U22.8(VREF) U25.6(AREF)
VMON_nCS: R31.1 U9.6(O2) U42.5(nCS)
VMONITOR_CSn: R30.2 ; port VMONITOR_CSn  [project net VM_CSn]
NetD13_1: D13.1 U41.2(IN-) U41.6(Vout) U42.2(IN+)
NetD14_1: D14.1 U43.2(IN+) U44.2(IN-) U44.6(Vout)
NetP9_37: U11.3(C2) ; port FOOTSWITCH
NetR19_1: R19.1 U6.1(A1)
NetR20_1: R20.1 U6.7(O1) U25.1(MOSI)
NetR21_1: R21.1 U6.4(A2)
NetR23_1: R23.1 U8.1(A1)
NetR24_1: R24.1 U8.7(O1) U25.3(~{CS})
NetR25_1: R25.1 U8.4(A2)
NetR26_1: R26.1 U9.1(A1)
NetR30_1: R30.1 U9.4(A2)
NetR33_1: R33.1 U11.4(A2)
NetR35#1_1: R35#1.1 U11.7(O1) ; port MON_MISO
NetR37_2: R37.2 U11.1(A1)
NetR38_1: R38.1 U12.1(A)
NetR44_1: R44.1 U14.1(A)
NetR48_1: R48.1 U15.1(A)
NetR76_1: R76.1 R82.2 U23.5(IN+) U25.7(OUT)
NetR82_1: R82.1 U23.3(IN+)
NetR84_2: R84.2 R101.2 U23.2(IN-)
NetR104_1: R104.1 R105.2 U41.3(IN+)
NetR121_1: R121.1 R130.1 U44.3(IN+)
NetR157_1: U8.6(O2) ; port PULSE_OUT

Not connected (* = marked no-connect by the designer): U22 4(NC)* 5(NC)*; U25 4(MISO)*; U41 1(NC)* 5(NC)* 8(NC)*; U44 1(NC)* 5(NC)* 8(NC)*

### Notes on the sheet
- Connector jumper check
- To LDD CMOS input
- To LDD drain FAULT (MAX 50 mA)

### Library data of the parts
C8 C11 C14 C21 C32 C33 C35-C38 = ChipCap: Capacitor; Published: 8-Jun-2000; LatestRevisionDate: 17-Jul-2002; LatestRevisionNote: Re-released for DXP Platform.; PackageReference: RAD-0.3; Publisher: Altium Limited
D13 D14 = TVS Diode SMA
R19-R26 R29-R33 R35#1 R37-R39 R43 R44 R47 R48 R76 R77 R82 R84-R86 R101 R104 R105 R121 R130 = ChipRes: Chip resistor
U6 U8 U9 U11 = HCPL0631: 2-channel opto-coupler
U12 U14 U15 = Optoisolator1: 4-Pin Phototransistor Optocoupler; Published: 24-Mar-1999; LatestRevisionDate: 04-Mar-2005; LatestRevisionNote: Sch pins 3 & 4 Swapped.; DatasheetVersion: Nov-2003; PackageReference: DIP-4; Publisher: Altium Limited
U22 = TL431ACD: Adjustable Precision Shunt Regulator; Published: 15-Apr-2002; LatestRevisionDate: 13-Apr-2006; LatestRevisionNote: IPC-7351 Footprint Added.; DatasheetVersion: Oct-2000; PackageVersion: Jan-1998; PackageReference: D008; Publisher: Altium Limited; PackageDescription: 8-Pin Small Outline Integrated Circuit 1.27 mm Pitch; Code_IPC: SOIC127P600-8; ComponentLink1Description: Manufacturer Link; ComponentLink1URL: http://www.ti.com/; ComponentLink2Description: Datasheet; ComponentLink2URL: http://www-s.ti.com/sc/ds/tl431a.pdf
U23 = LM358AD: Dual Operational Amplifier; Published: 15-Apr-2002; LatestRevisionDate: 13-Apr-2006; LatestRevisionNote: IPC-7351 Footprint Added.; DatasheetVersion: Aug-1988; PackageVersion: Jan-1998; PackageReference: D008; Publisher: Altium Limited; PackageDescription: 8-Pin Small Outline Integrated Circuit 1.27 mm Pitch; Code_IPC: SOIC127P600-8; ComponentLink1Description: Manufacturer Link; ComponentLink1URL: http://www.ti.com/; ComponentLink2Description: Datasheet; ComponentLink2URL: http://www-s.ti.com/sc/ds/lm358.pdf
U25 = TLC6515: 10-bit analog to digiyal converter; Manufacturer: Texas Instruments
U41 U44 = MCP601: Operational Amplifier
U42 U43 = MCP3201-CI/MS: SAR 12-bit Analog-to-Digital  (A/D); Manufacturer: Microchip; Maximum Sampling Rate: 100 ksps; Supplier 1: Platan; Supplier 2: Terraelectronica; ComponentLink1Description: Datasheet; ComponentLink1URL: http://www.farnell.com/datasheets/1669366.pdf; Supplier Part Number 1: 200659200; Supplier Part Number 2: 181061

## Sheet MISC.SchDoc
size A3
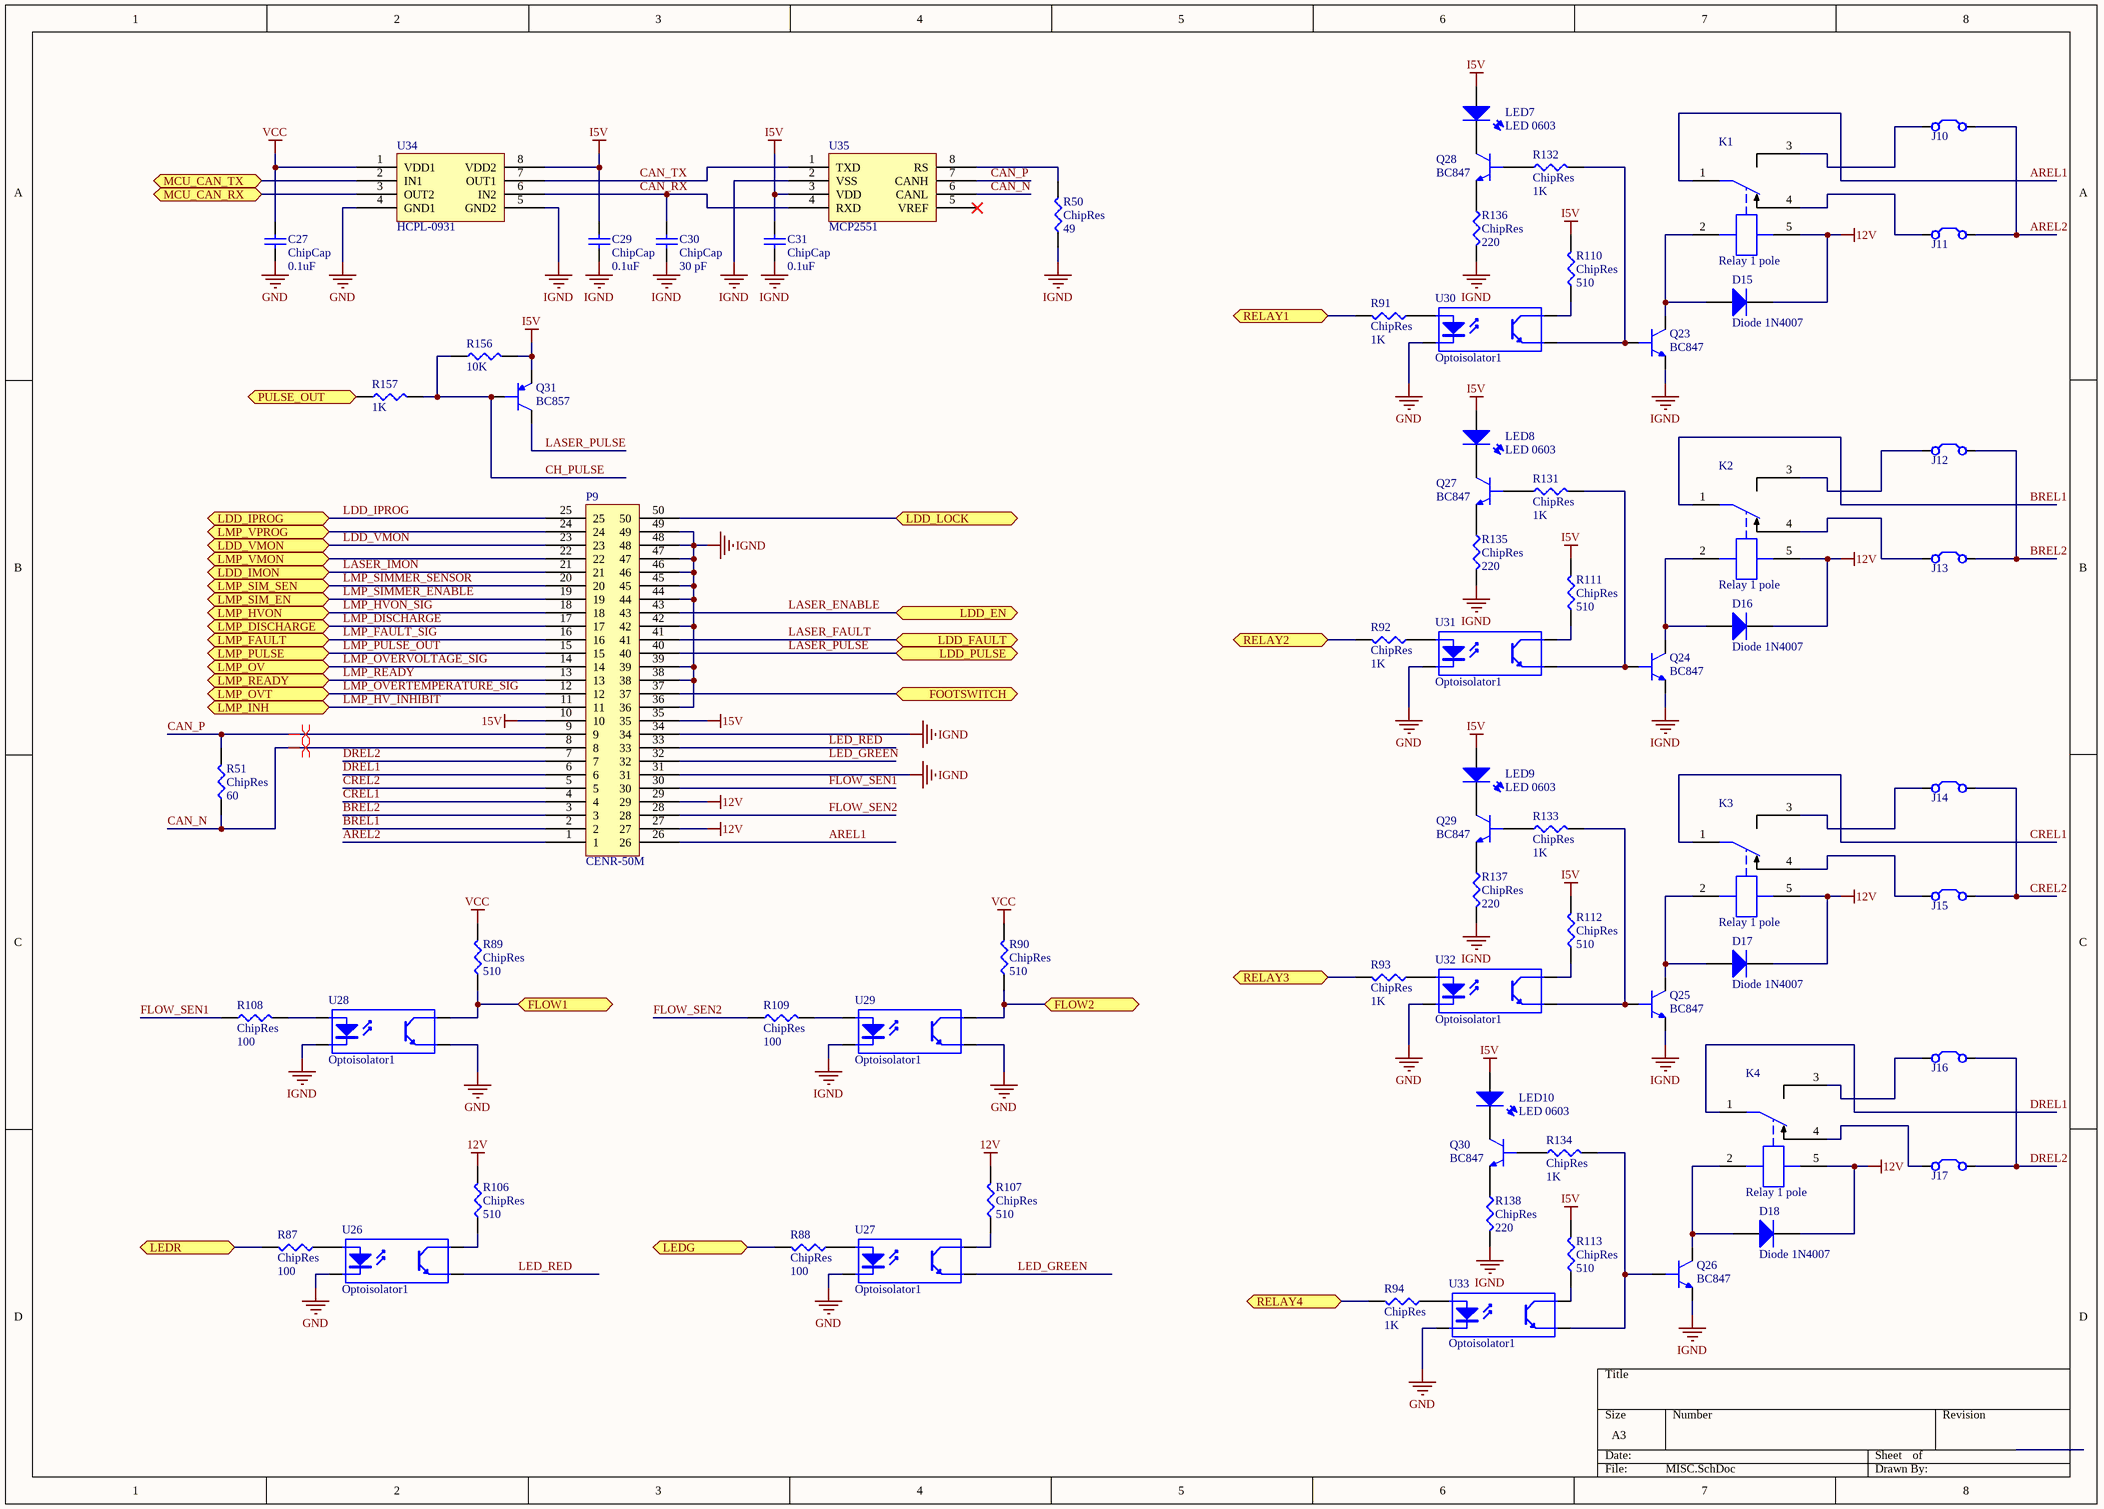
[diagram p5: MISC.SchDoc]

### Parts
C27  ChipCap  value 0.1uF  [CAP0805]
C29  ChipCap  value 0.1uF  [CAP0805]
C30  ChipCap  value 30 pF  [CAP0805]
C31  ChipCap  value 0.1uF  [CAP0805]
D15  Diode 1N4007  [DO-41]
D16  Diode 1N4007  [DO-41]
D17  Diode 1N4007  [DO-41]
D18  Diode 1N4007  [DO-41]
J10  Jumper  [J0805]  (value not drawn)  (net tie, no BOM)
J11  Jumper  [J0805]  (value not drawn)  (net tie, no BOM)
J12  Jumper  [J0805]  (value not drawn)  (net tie, no BOM)
J13  Jumper  [J0805]  (value not drawn)  (net tie, no BOM)
J14  Jumper  [J0805]  (value not drawn)  (net tie, no BOM)
J15  Jumper  [J0805]  (value not drawn)  (net tie, no BOM)
J16  Jumper  [J0805]  (value not drawn)  (net tie, no BOM)
J17  Jumper  [J0805]  (value not drawn)  (net tie, no BOM)
K1  Relay 1 pole  [G5LA]
K2  Relay 1 pole  [G5LA]
K3  Relay 1 pole  [G5LA]
K4  Relay 1 pole  [G5LA]
LED7  LED 0603  [LED 0603]
LED8  LED 0603  [LED 0603]
LED9  LED 0603  [LED 0603]
LED10  LED 0603  [LED 0603]
P9  CENR-50M  [CENR-50M]
Q23  BC847  [SOT23]
Q24  BC847  [SOT23]
Q25  BC847  [SOT23]
Q26  BC847  [SOT23]
Q27  BC847  [SOT23]
Q28  BC847  [SOT23]
Q29  BC847  [SOT23]
Q30  BC847  [SOT23]
Q31  BC857  [SOT23]
R50  ChipRes  value 49  [RES0805]
R51  ChipRes  value 60  [RES0805]
R87  ChipRes  value 100  [RES0805]
R88  ChipRes  value 100  [RES0805]
R89  ChipRes  value 510  [RES0805]
R90  ChipRes  value 510  [RES0805]
R91  ChipRes  value 1K  [RES0805]
R92  ChipRes  value 1K  [RES0805]
R93  ChipRes  value 1K  [RES0805]
R94  ChipRes  value 1K  [RES0805]
R106  ChipRes  value 510  [RES0805]
R107  ChipRes  value 510  [RES0805]
R108  ChipRes  value 100  [RES0805]
R109  ChipRes  value 100  [RES0805]
R110  ChipRes  value 510  [RES0805]
R111  ChipRes  value 510  [RES0805]
R112  ChipRes  value 510  [RES0805]
R113  ChipRes  value 510  [RES0805]
R131  ChipRes  value 1K  [RES0805]
R132  ChipRes  value 1K  [RES0805]
R133  ChipRes  value 1K  [RES0805]
R134  ChipRes  value 1K  [RES0805]
R135  ChipRes  value 220  [RES0805]
R136  ChipRes  value 220  [RES0805]
R137  ChipRes  value 220  [RES0805]
R138  ChipRes  value 220  [RES0805]
R156  value 10K  [RES0805]  (hidden comment: ChipRes)
R157  value 1K  [RES0805]  (hidden comment: ChipRes)
U26  Optoisolator1  [DIP-4]
U27  Optoisolator1  [DIP-4]
U28  Optoisolator1  [DIP-4]
U29  Optoisolator1  [DIP-4]
U30  Optoisolator1  [DIP-4]
U31  Optoisolator1  [DIP-4]
U32  Optoisolator1  [DIP-4]
U33  Optoisolator1  [DIP-4]
U34  HCPL-0931  [SOIC8]
U35  MCP2551  [SOIC8]

### Ports
FLOW1, FLOW2, FOOTSWITCH, LDD_EN, LDD_FAULT, LDD_IMON, LDD_IPROG, LDD_LOCK, LDD_PULSE, LDD_VMON, LEDG, LEDR, LMP_DISCHARGE, LMP_FAULT, LMP_HVON, LMP_INH, LMP_OV, LMP_OVT, LMP_PULSE, LMP_READY, LMP_SIM_EN, LMP_SIM_SEN, LMP_VMON, LMP_VPROG, MCU_CAN_RX, MCU_CAN_TX, PULSE_OUT, RELAY1, RELAY2, RELAY3, RELAY4

### Nets
12V: D15.2(K) D16.2(K) D17.2(K) D18.2(K) K1.5 K2.5 K3.5 K4.5 P9.27 P9.29 R106.2 R107.2
15V: P9.10 P9.35
GND: C27.2 U26.2(K) U27.2(K) U28.3(E) U29.3(E) U30.2(K) U31.2(K) U32.2(K) U33.2(K) U34.4(GND1)
I5V: C29.1 C31.1 LED7.2 LED8.2 LED9.2 LED10.2 Q31.2 R110.2 R111.2 R112.2 R113.2 R156.2 U34.8(VDD2) U35.3(VDD)
IGND: C29.2 C30.2 C31.2 P9.31 P9.34 P9.36 P9.38 P9.39 P9.42 P9.44 P9.45 P9.46 P9.47 P9.48 P9.49 Q23.2 Q24.2 Q25.2 Q26.2 R50.1 R135.1 R136.1 R137.1 R138.1 U28.2(K) U29.2(K) U34.5(GND2) U35.2(VSS)
VCC: C27.1 R89.2 R90.2 U34.1(VDD1)
AREL1: K1.1 P9.26
AREL2: J10.1 J11.1 P9.1
BREL1: K2.1 P9.2
BREL2: J12.1 J13.1 P9.3
CAN1_RX: U34.3(OUT2) ; port MCU_CAN_RX
CAN1_TX: U34.2(IN1) ; port MCU_CAN_TX
CAN_N: P9.8 R51.1 U35.6(CANL)
CAN_P: P9.9 R51.2 U35.7(CANH)
CAN_RX: C30.1 U34.6(IN2) U35.4(RXD)
CAN_TX: U34.7(OUT1) U35.1(TXD)
CH_PULSE: Q31.1 R156.1 R157.2
CREL1: K3.1 P9.4
CREL2: J14.1 J15.1 P9.5
DREL1: K4.1 P9.6
DREL2: J16.1 J17.1 P9.7
FLOW1: R89.1 U28.4(C) ; port FLOW1
FLOW2: R90.1 U29.4(C) ; port FLOW2
FLOW_SEN1: P9.30 R108.2
FLOW_SEN2: P9.28 R109.2
LASER_ENABLE: P9.43 ; port LDD_EN
LASER_FAULT: P9.41 ; port LDD_FAULT  [project net CH_NERR]
LASER_IMON: P9.21 ; port LDD_IMON
LASER_LOCK: P9.50 ; port LDD_LOCK
LASER_PULSE: P9.40 Q31.3 ; port LDD_PULSE
LASER_VMON: P9.22 ; port LMP_VMON
LDD_IPROG: P9.24 P9.25 ; port LMP_VPROG, port LDD_IPROG  [project net LASER_IPROG]
LDD_VMON: P9.23 ; port LDD_VMON
LED_GREEN: P9.32 U27.3(E)
LED_RED: P9.33 U26.3(E)
LEDG: R88.2 ; port LEDG
LEDR: R87.2 ; port LEDR
LMP_DISCHARGE: P9.17 ; port LMP_DISCHARGE
LMP_FAULT_SIG: P9.16 ; port LMP_FAULT
LMP_HV_INHIBIT: P9.11 ; port LMP_INH
LMP_HVON_SIG: P9.18 ; port LMP_HVON
LMP_OVERTEMPERATURE_SIG: P9.12 ; port LMP_OVT
LMP_OVERVOLTAGE_SIG: P9.14 ; port LMP_OV
LMP_PULSE_OUT: P9.15 ; port LMP_PULSE
LMP_READY: P9.13 ; port LMP_READY
LMP_SIMMER_ENABLE: P9.19 ; port LMP_SIM_EN
LMP_SIMMER_SENSOR: P9.20 ; port LMP_SIM_SEN
RELAY1: R91.2 ; port RELAY1
RELAY2: R92.2 ; port RELAY2
RELAY3: R93.2 ; port RELAY3
RELAY4: R94.2 ; port RELAY4
NetD15_1: D15.1(A) K1.2 Q23.3
NetD16_1: D16.1(A) K2.2 Q24.3
NetD17_1: D17.1(A) K3.2 Q25.3
NetD18_1: D18.1(A) K4.2 Q26.3
NetJ10_0: J10.0 K1.3
NetJ11_0: J11.0 K1.4
NetJ12_0: J12.0 K2.3
NetJ13_0: J13.0 K2.4
NetJ14_0: J14.0 K3.3
NetJ15_0: J15.0 K3.4
NetJ16_0: J16.0 K4.3
NetJ17_0: J17.0 K4.4
NetLED7_1: LED7.1 Q28.3
NetLED8_1: LED8.1 Q27.3
NetLED9_1: LED9.1 Q29.3
NetLED10_1: LED10.1 Q30.3
NetP9_37: P9.37 ; port FOOTSWITCH
NetQ23_1: Q23.1 R132.1 U30.3(E)
NetQ24_1: Q24.1 R131.1 U31.3(E)
NetQ25_1: Q25.1 R133.1 U32.3(E)
NetQ26_1: Q26.1 R134.1 U33.3(E)
NetQ27_1: Q27.1 R131.2
NetQ27_2: Q27.2 R135.2
NetQ28_1: Q28.1 R132.2
NetQ28_2: Q28.2 R136.2
NetQ29_1: Q29.1 R133.2
NetQ29_2: Q29.2 R137.2
NetQ30_1: Q30.1 R134.2
NetQ30_2: Q30.2 R138.2
NetR50_2: R50.2 U35.8(RS)
NetR87_1: R87.1 U26.1(A)
NetR88_1: R88.1 U27.1(A)
NetR91_1: R91.1 U30.1(A)
NetR92_1: R92.1 U31.1(A)
NetR93_1: R93.1 U32.1(A)
NetR94_1: R94.1 U33.1(A)
NetR106_1: R106.1 U26.4(C)
NetR107_1: R107.1 U27.4(C)
NetR108_1: R108.1 U28.1(A)
NetR109_1: R109.1 U29.1(A)
NetR110_1: R110.1 U30.4(C)
NetR111_1: R111.1 U31.4(C)
NetR112_1: R112.1 U32.4(C)
NetR113_1: R113.1 U33.4(C)
NetR157_1: R157.1 ; port PULSE_OUT

Not connected (* = marked no-connect by the designer): U35 5(VREF)*

### Layout directives
differential pair: CAN_N, CAN_P

### Library data of the parts
C27 C29-C31 = ChipCap: Capacitor; Published: 8-Jun-2000; LatestRevisionDate: 17-Jul-2002; LatestRevisionNote: Re-released for DXP Platform.; PackageReference: RAD-0.3; Publisher: Altium Limited
D15-D18 = Diode 1N4007: 1 Amp General Purpose Rectifier; Published: 8-Jun-2000; LatestRevisionDate: 17-Jul-2002; LatestRevisionNote: Re-released for DXP Platform.; DatasheetVersion: 1998; PackageVersion: Aug-1999; PackageReference: DO-41; Publisher: Altium Limited; PackageDescription: Diode, Axial; Body 5.2 x 2.7 mm (LxDia. max), Lead Dia. 0.86 mm (max); Code_JEDEC: DO-204-AL; ComponentLink1Description: Manufacturer Link; ComponentLink1URL: http://www.fairchildsemi.com/; ComponentLink2Description: Datasheet; ComponentLink2URL: http://www.fairchildsemi.com/ds/1N%2F1N4001.pdf
K1-K4 = Relay G5LE: Relay G5LE 10A Single Pole
LED7-LED10 = LED0603
Q23-Q30 = BC847: NPN transistor
Q31 = BC857: PNP Transistor
R50 R51 R87-R94 R106-R113 R131-R138 R156 R157 = ChipRes: Chip resistor
U26-U33 = Optoisolator1: 4-Pin Phototransistor Optocoupler; Published: 24-Mar-1999; LatestRevisionDate: 04-Mar-2005; LatestRevisionNote: Sch pins 3 & 4 Swapped.; DatasheetVersion: Nov-2003; PackageReference: DIP-4; Publisher: Altium Limited
U34 = HCPL-0931-000E: 2-bit bi-direction optoisolated buffer
U35 = MCP2551-I/SN: CAN Transceiver

## Sheet DischargeModule.SchDoc
size A3
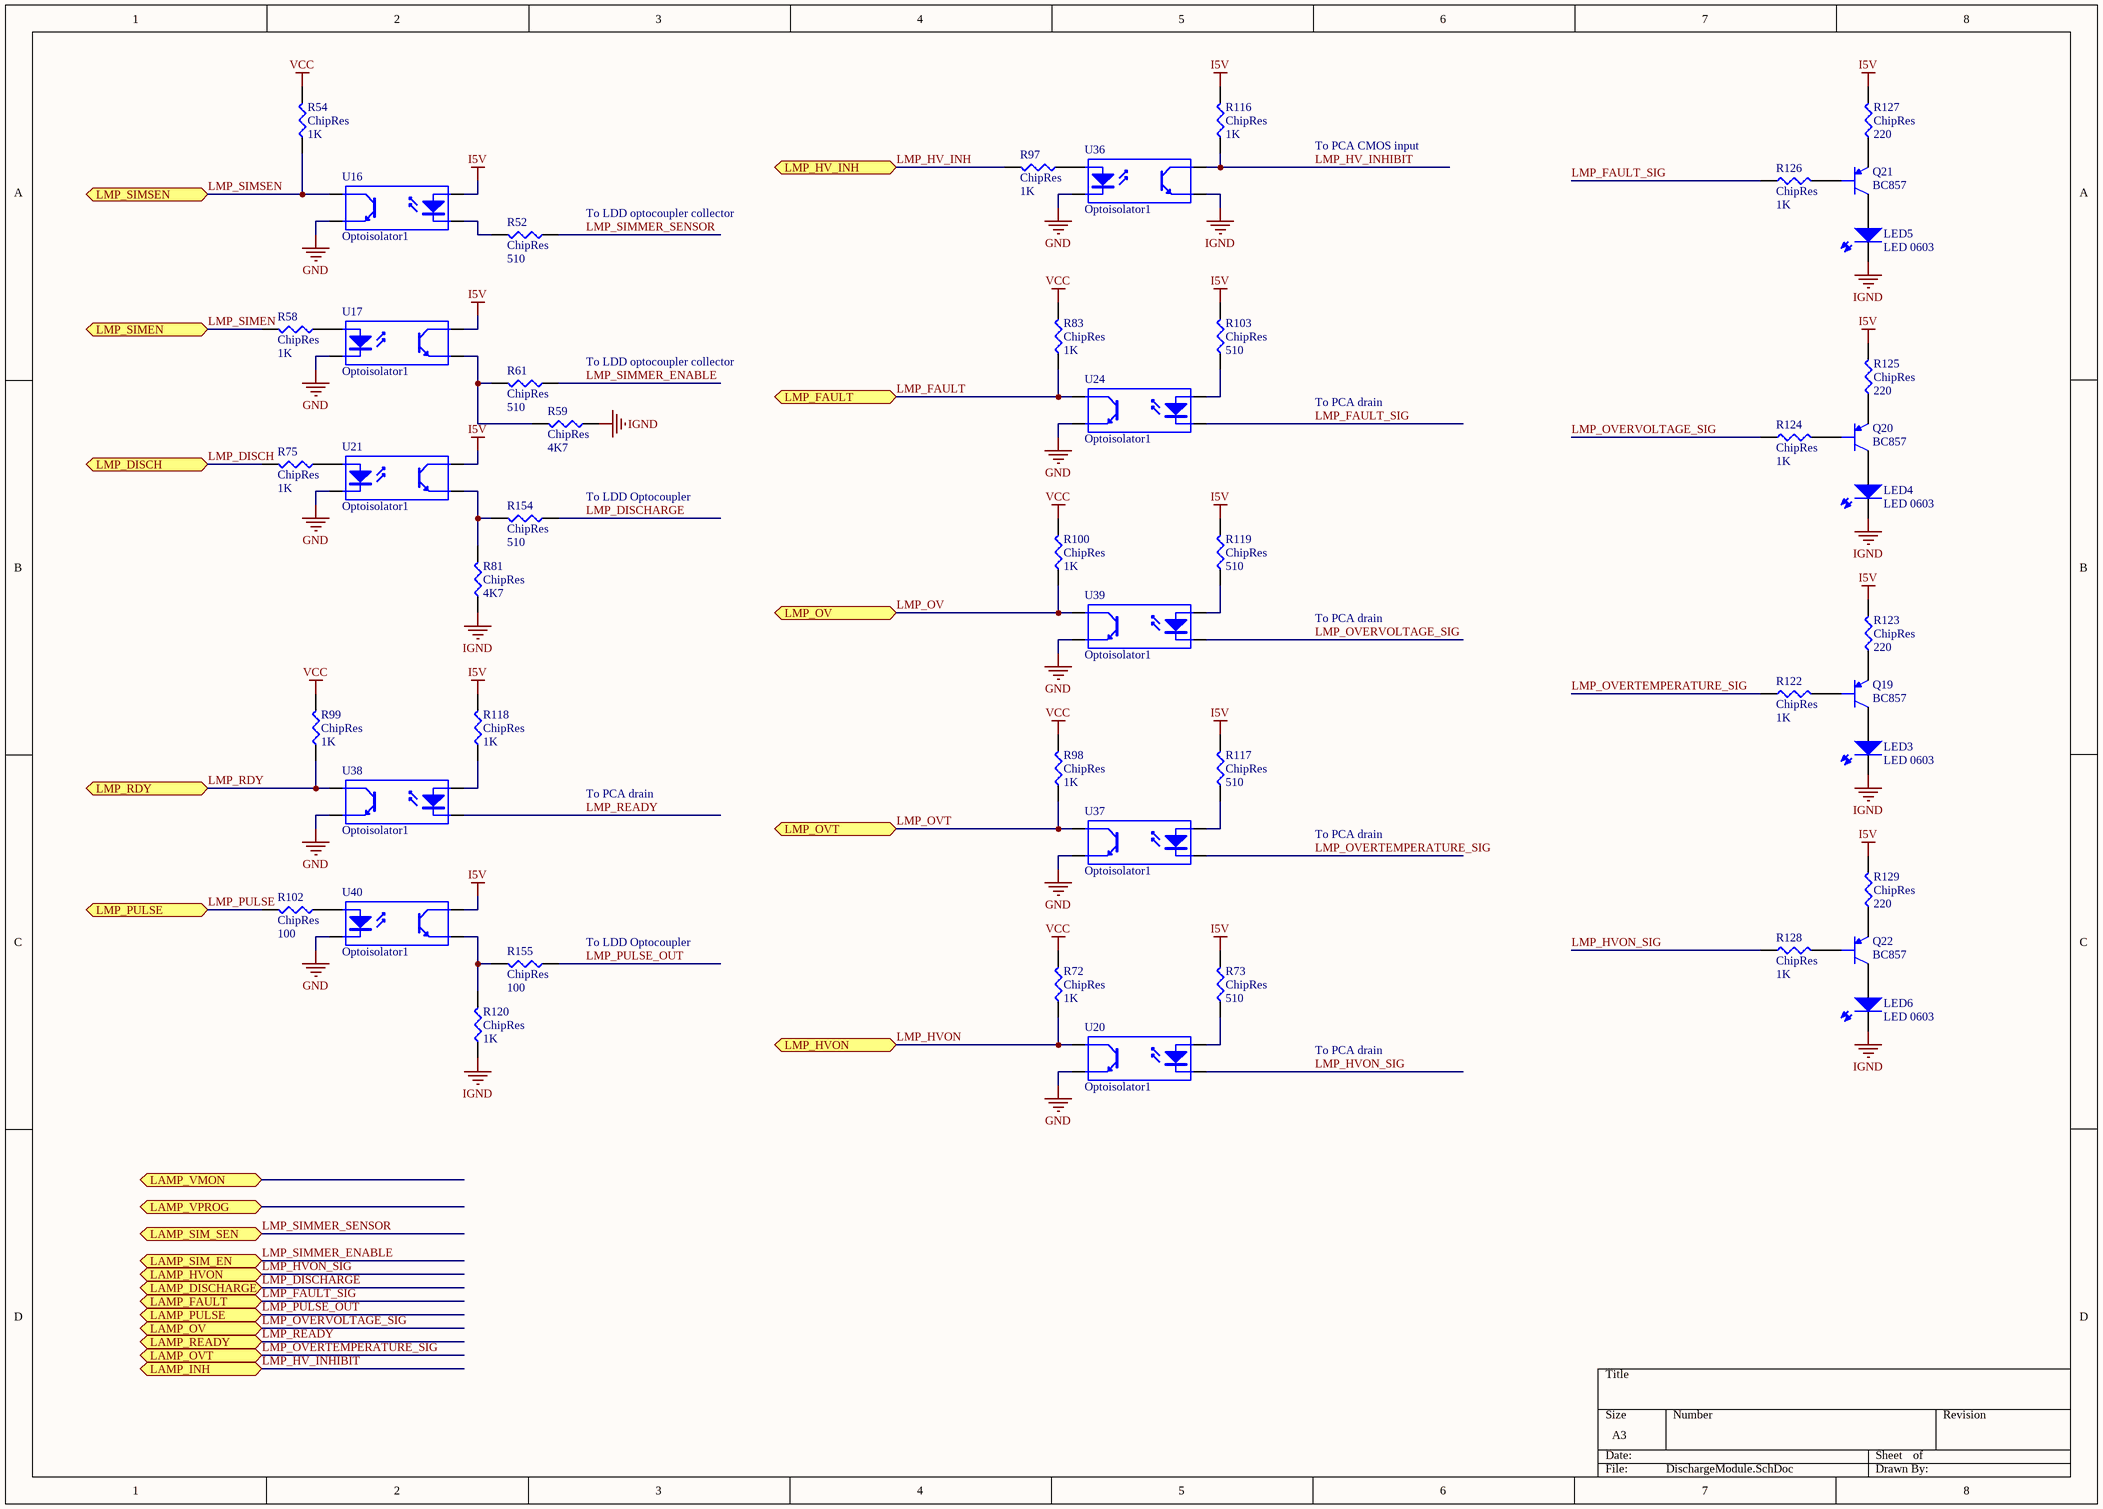
[diagram p6: DischargeModule.SchDoc]

### Parts
LED3  LED 0603  [PLCC-2]
LED4  LED 0603  [PLCC-2]
LED5  LED 0603  [PLCC-2]
LED6  LED 0603  [PLCC-2]
Q19  BC857  [SOT23]
Q20  BC857  [SOT23]
Q21  BC857  [SOT23]
Q22  BC857  [SOT23]
R52  ChipRes  value 510  [RES0805]
R54  ChipRes  value 1K  [RES0805]
R58  ChipRes  value 1K  [RES0805]
R59  ChipRes  value 4K7  [RES0805]
R61  ChipRes  value 510  [RES0805]
R72  ChipRes  value 1K  [RES0805]
R73  ChipRes  value 510  [RES0805]
R75  ChipRes  value 1K  [RES0805]
R81  ChipRes  value 4K7  [RES0805]
R83  ChipRes  value 1K  [RES0805]
R97  ChipRes  value 1K  [RES0805]
R98  ChipRes  value 1K  [RES0805]
R99  ChipRes  value 1K  [RES0805]
R100  ChipRes  value 1K  [RES0805]
R102  ChipRes  value 100  [RES0805]
R103  ChipRes  value 510  [RES0805]
R116  ChipRes  value 1K  [RES0805]
R117  ChipRes  value 510  [RES0805]
R118  ChipRes  value 1K  [RES0805]
R119  ChipRes  value 510  [RES0805]
R120  ChipRes  value 1K  [RES0805]
R122  ChipRes  value 1K  [RES0805]
R123  ChipRes  value 220  [RES0805]
R124  ChipRes  value 1K  [RES0805]
R125  ChipRes  value 220  [RES0805]
R126  ChipRes  value 1K  [RES0805]
R127  ChipRes  value 220  [RES0805]
R128  ChipRes  value 1K  [RES0805]
R129  ChipRes  value 220  [RES0805]
R154  ChipRes  value 510  [RES0805]
R155  ChipRes  value 100  [RES0805]
U16  Optoisolator1  [DIP-4]
U17  Optoisolator1  [DIP-4]
U20  Optoisolator1  [DIP-4]
U21  Optoisolator1  [DIP-4]
U24  Optoisolator1  [DIP-4]
U36  Optoisolator1  [DIP-4]
U37  Optoisolator1  [DIP-4]
U38  Optoisolator1  [DIP-4]
U39  Optoisolator1  [DIP-4]
U40  Optoisolator1  [DIP-4]

### Ports
LAMP_DISCHARGE, LAMP_FAULT, LAMP_HVON, LAMP_INH, LAMP_OV, LAMP_OVT, LAMP_PULSE, LAMP_READY, LAMP_SIM_EN, LAMP_SIM_SEN, LAMP_VMON, LAMP_VPROG, LMP_DISCH, LMP_FAULT, LMP_HV_INH, LMP_HVON, LMP_OV, LMP_OVT, LMP_PULSE, LMP_RDY, LMP_SIMEN, LMP_SIMSEN

### Nets
GND: U16.3(E) U17.2(K) U20.3(E) U21.2(K) U24.3(E) U36.2(K) U37.3(E) U38.3(E) U39.3(E) U40.2(K)
I5V: R73.2 R103.2 R116.2 R117.2 R118.2 R119.2 R123.2 R125.2 R127.2 R129.2 U16.1(A) U17.4(C) U21.4(C) U40.4(C)
IGND: LED3.1 LED4.1 LED5.1 LED6.1 R59.1 R81.1 R120.1 U36.3(E)
VCC: R54.2 R72.2 R83.2 R98.2 R99.2 R100.2
LMP_DISCH: R75.2 ; port LMP_DISCH
LMP_DISCHARGE: R154.1 ; port LAMP_DISCHARGE
LMP_FAULT: R83.1 U24.4(C) ; port LMP_FAULT
LMP_FAULT_SIG: R126.1 U24.2(K) ; port LAMP_FAULT
LMP_HV_INH: R97.2 ; port LMP_HV_INH
LMP_HV_INHIBIT: R116.1 U36.4(C) ; port LAMP_INH
LMP_HVON: R72.1 U20.4(C) ; port LMP_HVON
LMP_HVON_SIG: R128.1 U20.2(K) ; port LAMP_HVON
LMP_OV: R100.1 U39.4(C) ; port LMP_OV
LMP_OVERTEMPERATURE_SIG: R122.1 U37.2(K) ; port LAMP_OVT
LMP_OVERVOLTAGE_SIG: R124.1 U39.2(K) ; port LAMP_OV
LMP_OVT: R98.1 U37.4(C) ; port LMP_OVT
LMP_PULSE: R102.2 ; port LMP_PULSE
LMP_PULSE_OUT: R155.1 ; port LAMP_PULSE
LMP_RDY: R99.1 U38.4(C) ; port LMP_RDY
LMP_READY: U38.2(K) ; port LAMP_READY
LMP_SIMEN: R58.2 ; port LMP_SIMEN
LMP_SIMMER_ENABLE: R61.1 ; port LAMP_SIM_EN
LMP_SIMMER_SENSOR: R52.1 ; port LAMP_SIM_SEN
LMP_SIMSEN: R54.1 U16.4(C) ; port LMP_SIMSEN
NetLED3_2: LED3.2 Q19.3
NetLED4_2: LED4.2 Q20.3
NetLED5_2: LED5.2 Q21.3
NetLED6_2: LED6.2 Q22.3
NetQ19_1: Q19.1 R122.2
NetQ19_2: Q19.2 R123.1
NetQ20_1: Q20.1 R124.2
NetQ20_2: Q20.2 R125.1
NetQ21_1: Q21.1 R126.2
NetQ21_2: Q21.2 R127.1
NetQ22_1: Q22.1 R128.2
NetQ22_2: Q22.2 R129.1
NetR52_2: R52.2 U16.2(K)
NetR58_1: R58.1 U17.1(A)
NetR59_2: R59.2 R61.2 U17.3(E)
NetR73_1: R73.1 U20.1(A)
NetR75_1: R75.1 U21.1(A)
NetR81_2: R81.2 R154.2 U21.3(E)
NetR97_1: R97.1 U36.1(A)
NetR102_1: R102.1 U40.1(A)
NetR103_1: R103.1 U24.1(A)
NetR117_1: R117.1 U37.1(A)
NetR118_1: R118.1 U38.1(A)
NetR119_1: R119.1 U39.1(A)
NetR120_2: R120.2 R155.2 U40.3(E)

### Notes on the sheet
- To PCA CMOS input
- (near R52) To LDD optocoupler collector
- To LDD optocoupler collector
- To PCA drain
- To LDD Optocoupler
- (near R155) To LDD Optocoupler

### Library data of the parts
LED3-LED6 = LED0603
Q19-Q22 = BC857: PNP Transistor
R52 R54 R58 R59 R61 R72 R73 R75 R81 R83 R97-R100 R102 R103 R116-R120 R122-R129 R154 R155 = ChipRes: Chip resistor
U16 U17 U20 U21 U24 U36-U40 = Optoisolator1: 4-Pin Phototransistor Optocoupler; Published: 24-Mar-1999; LatestRevisionDate: 04-Mar-2005; LatestRevisionNote: Sch pins 3 & 4 Swapped.; DatasheetVersion: Nov-2003; PackageReference: DIP-4; Publisher: Altium Limited

## Sheet MCUPower.SchDoc
size A4
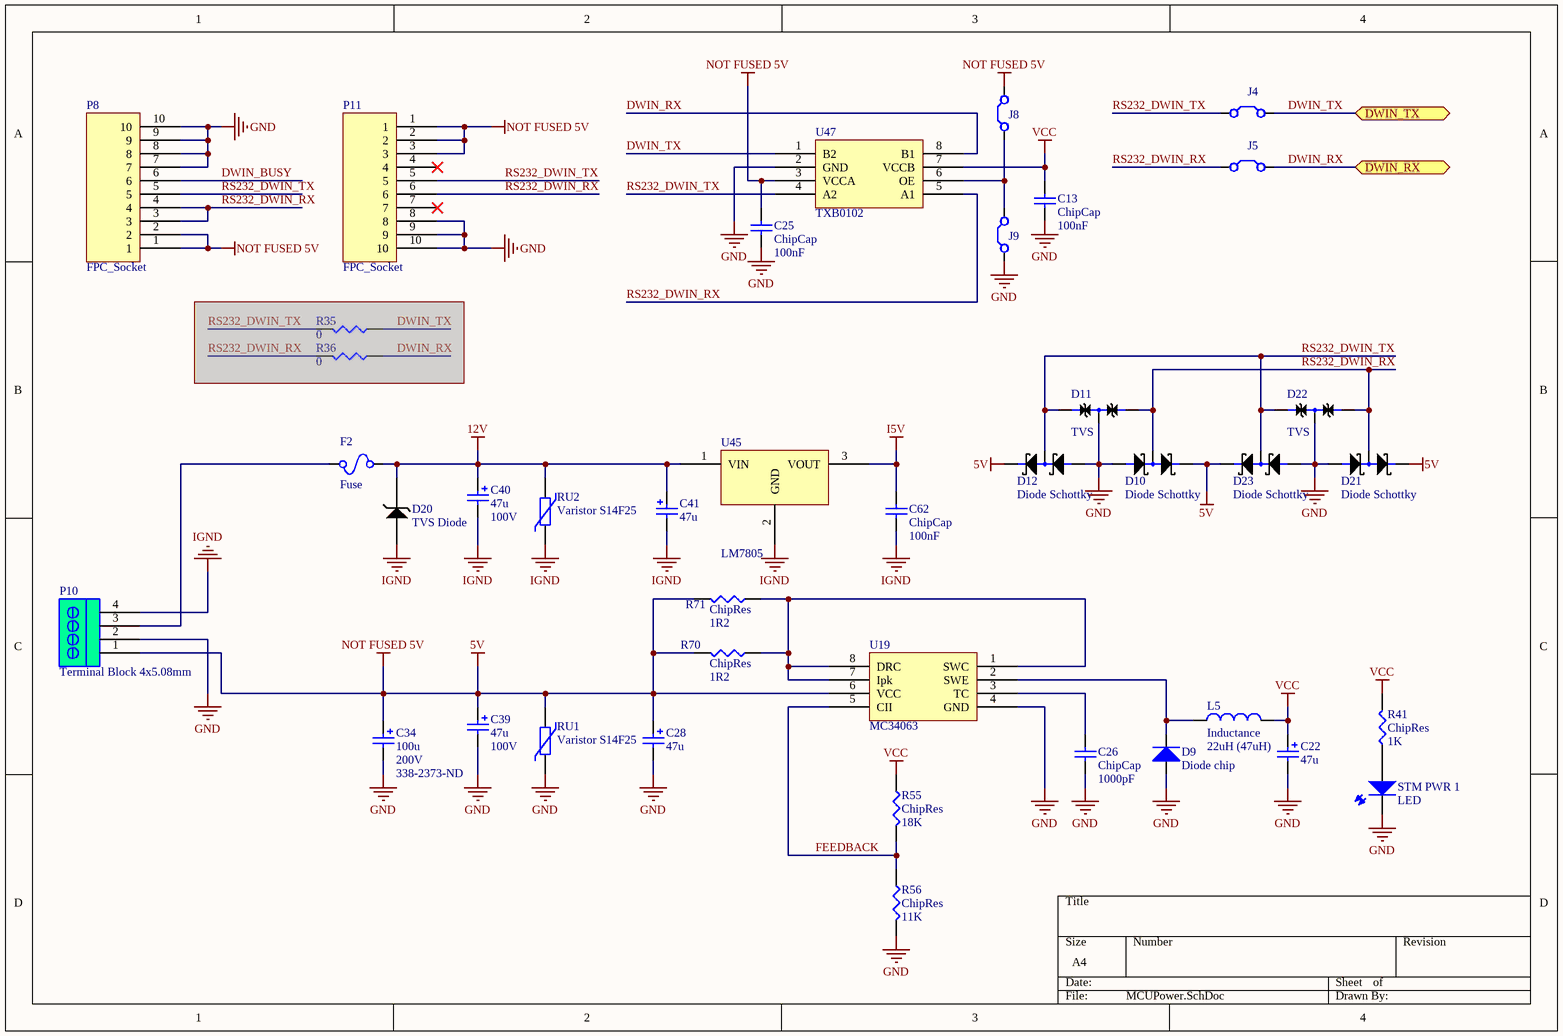
[diagram p7: MCUPower.SchDoc]

### Parts
(Parts that share a designator on the sheet are numbered #1, #2 ... from top to bottom, then left to right.)
C13  ChipCap  value 100nF  [CAP0805]
C22  value 47u  [CAPC7343]  (hidden comment: Cap Pol SMD)
C25  ChipCap  value 100nF  [CAP0805]
C26  ChipCap  value 1000pF  [CAP0805]
C28  value 47u  [CAPC7343]  (hidden comment: Cap Pol SMD)
C34  value 100u  Voltage: 200V  Supplier Part Number 1: 338-2373-ND  [CAPPR7.5-16x25_1]  (hidden comment: Cap Pol 200/100)
C39  value 47u  Voltage: 100V  [CAPPR5-10x17_1]  (hidden comment: Cap Pol 100/47)
C40  value 47u  Voltage: 100V  [CAPPR5-10x17_1]  (hidden comment: Cap Pol 100/47)
C41  value 47u  [CAPC7343]  (hidden comment: Cap Pol SMD)
C62  ChipCap  value 100nF  [CAP0805]
D9  Diode chip  [SMB1]
D10  Diode Schottky  [SOT23]
D11  TVS  [SOT23]
D12  Diode Schottky  [SOT23]
D20  TVS Diode  [DO-214AS]
D21  Diode Schottky  [SOT23]
D22  TVS  [SOT23]
D23  Diode Schottky  [SOT23]
F2  Fuse  [PTC1812]
J4  Jumper  [J0805]  (value not drawn)  (net tie, no BOM)
J5  Jumper  [J0805]  (value not drawn)  (net tie, no BOM)
J8  Jumper  [J0805]  (value not drawn)  (net tie, no BOM)
J9  Jumper  [J0805]  (value not drawn)  (net tie, no BOM)
L5  Inductance  value 22uH (47uH)  [IHPL-3232]
P8  FPC_Socket  [MOLEX Header 8 2mm Pitch]
P10  Terminal Block 4x5.08mm  [Socket 4x5.08]
P11  FPC_Socket  [Molex FPC/FFC 10pin]
R35#2  value 0  [RES0805]  (hidden comment: ChipRes)  (masked out: inside a compile mask, not in the netlist)
R36#2  value 0  [RES0805]  (hidden comment: ChipRes)  (masked out: inside a compile mask, not in the netlist)
R41  ChipRes  value 1K  [RES0805]
R55  ChipRes  value 18K  [RES0805]
R56  ChipRes  value 11K  [RES0805]
R70  ChipRes  value 1R2  [RES0805]
R71  ChipRes  value 1R2  [RES0805]
RU1  Varistor S14F25  [S14K25]
RU2  Varistor S14F25  [S14K25]
STM_PWR_1  LED  [PLCC-2]
U19  MC34063  [SOP8]
U45  LM7805  [TO-220]
U47  TXB0102  [SOIC8]

### Ports
DWIN_RX, DWIN_TX

### Nets
5V: C25.2 C28.1 C34.1 C39.1 D10.2 D12.2 D21.2 D23.2 J8.1 P8.1 P8.2 P10.1 P11.1 P11.2 P11.3 R70.2 R71.2 RU1.2 U19.6(VCC) U47.3(VCCA)  [also labelled NOT FUSED 5V]
12V: C40.1 C41.1 D20.1 F2.1 RU2.2 U45.1(VIN)
GND: C13.1 C22.2 C25.1 C26.1 C28.2 C34.2 C39.2 D9.1(A) D10.1 D11.3 D12.1 D21.1 D22.3 D23.1 J9.0 P8.7 P8.8 P8.9 P8.10 P10.2 P11.8 P11.9 P11.10 R56.2 RU1.1 STM_PWR_1.1 U19.4(GND) U47.2(GND)
I5V: C62.2 U45.3(VOUT)
IGND: C40.2 C41.2 C62.1 D20.2 P10.4 RU2.1 U45.2(GND)
VCC: C13.2 C22.1 L5.1 R41.2 R55.1 U47.7(VCCB)
DWIN_BUSY: P8.6
DWIN_RX: J5.1 U47.8(B1) ; port DWIN_RX
DWIN_TX: J4.1 U47.1(B2) ; port DWIN_TX
FEEDBACK: R55.2 R56.1 U19.5(CII)
RS232_DWIN_RX: D10.3 D11.2 D21.3 D22.2 J5.0 P8.3 P8.4 P11.6 U47.5(A1)
RS232_DWIN_TX: D11.1 D12.3 D22.1 D23.3 J4.0 P8.5 P11.5 U47.4(A2)
NetC26_2: C26.2 U19.3(TC)
NetD9_2: D9.2(K) L5.2 U19.2(SWE)
NetF2_2: F2.2 P10.3
NetJ8_0: J8.0 J9.1 U47.6(OE)
NetR41_1: R41.1 STM_PWR_1.2
NetR70_1: R70.1 R71.1 U19.1(SWC) U19.7(Ipk) U19.8(DRC)

Not connected (* = marked no-connect by the designer): P11 4* 7*

### Library data of the parts
C13 C25 C26 C62 = ChipCap: Capacitor; Published: 8-Jun-2000; LatestRevisionDate: 17-Jul-2002; LatestRevisionNote: Re-released for DXP Platform.; PackageReference: RAD-0.3; Publisher: Altium Limited
C22 C28 C41 = Cap Pol Chip: Polarized Capacitor (Radial); Supplier 1: Digi-Key; Supplier Part Number 1: 399-4029-1-ND
C34 = Cap Pol 200/100: Polarized Capacitor (Radial); Supplier 1: Digi-Key
C39 C40 = Cap Pol 100/47: Polarized Capacitor (Radial); Supplier 1: Digi-Key; Supplier Part Number 1: P1284-ND
D9 = Diode chip: Voltage: 1000V; Current (continuous): 3A; Current (peak, sine 8,3 ms): 150V; Junction capacitance: 50pF
D10 D12 D21 D23 = Schottky Diode: 2-Diode Schottky
D11 D22 = TVS Diode: Dual bidirectional voltage supresor
D20 = TVS Diode SMA
F2 = Fuse PTC1812: Fuse PTC 1812 Thermoresistor
L5 = ChipInductance
P10 = Socket_4x5.08_RA_2Wall: as P5 on sheet IsolatedPeltierDriver
R35#2 R36#2 R41 R55 R56 R70 R71 = ChipRes: Chip resistor
RU1 RU2 = Varistor S14K25: varistor
STM_PWR_1 = LED0603
U19 = MC34063: DC/DC converter control circuit; ComponentLink1Description: Datasheet; ComponentLink1URL: https://www.terraelectronica.ru/show_pdf.php?pdf=%2Fds%2Fpdf%2Fm%2Fmc34063acd-tr.pdf; HelpURL: MC34063; Supplier 1: Terraelectronica; Supplier Part Number 1: 356799; Supplier 2: Elgrad; Supplier Part Number 2: 30445; Supplier 3: Compel; Supplier Part Number 3: MC34063AG- S08-T(R)
U45 = LM7805: Linear voltage regulator 1A
U47 = TXB0102: 2-bit bidirectional voltage-level translator